# EasyEDA Pro project 弱磁场及磁感应强度矢量综合测量实验仪.eprj

# Schematic FD-MFD-A

## Sheets
1 主板和外围电路: Create Date: 2024-11-11; Page Name: 主板和外围电路; Project Name: 弱磁场及磁感应强度矢量综合测量实验仪; Schematic Name: FD-MFD-A; Update Date: 2026-04-02; Company: 嘉立创EDA; Page Size: A4; Version: V1.0
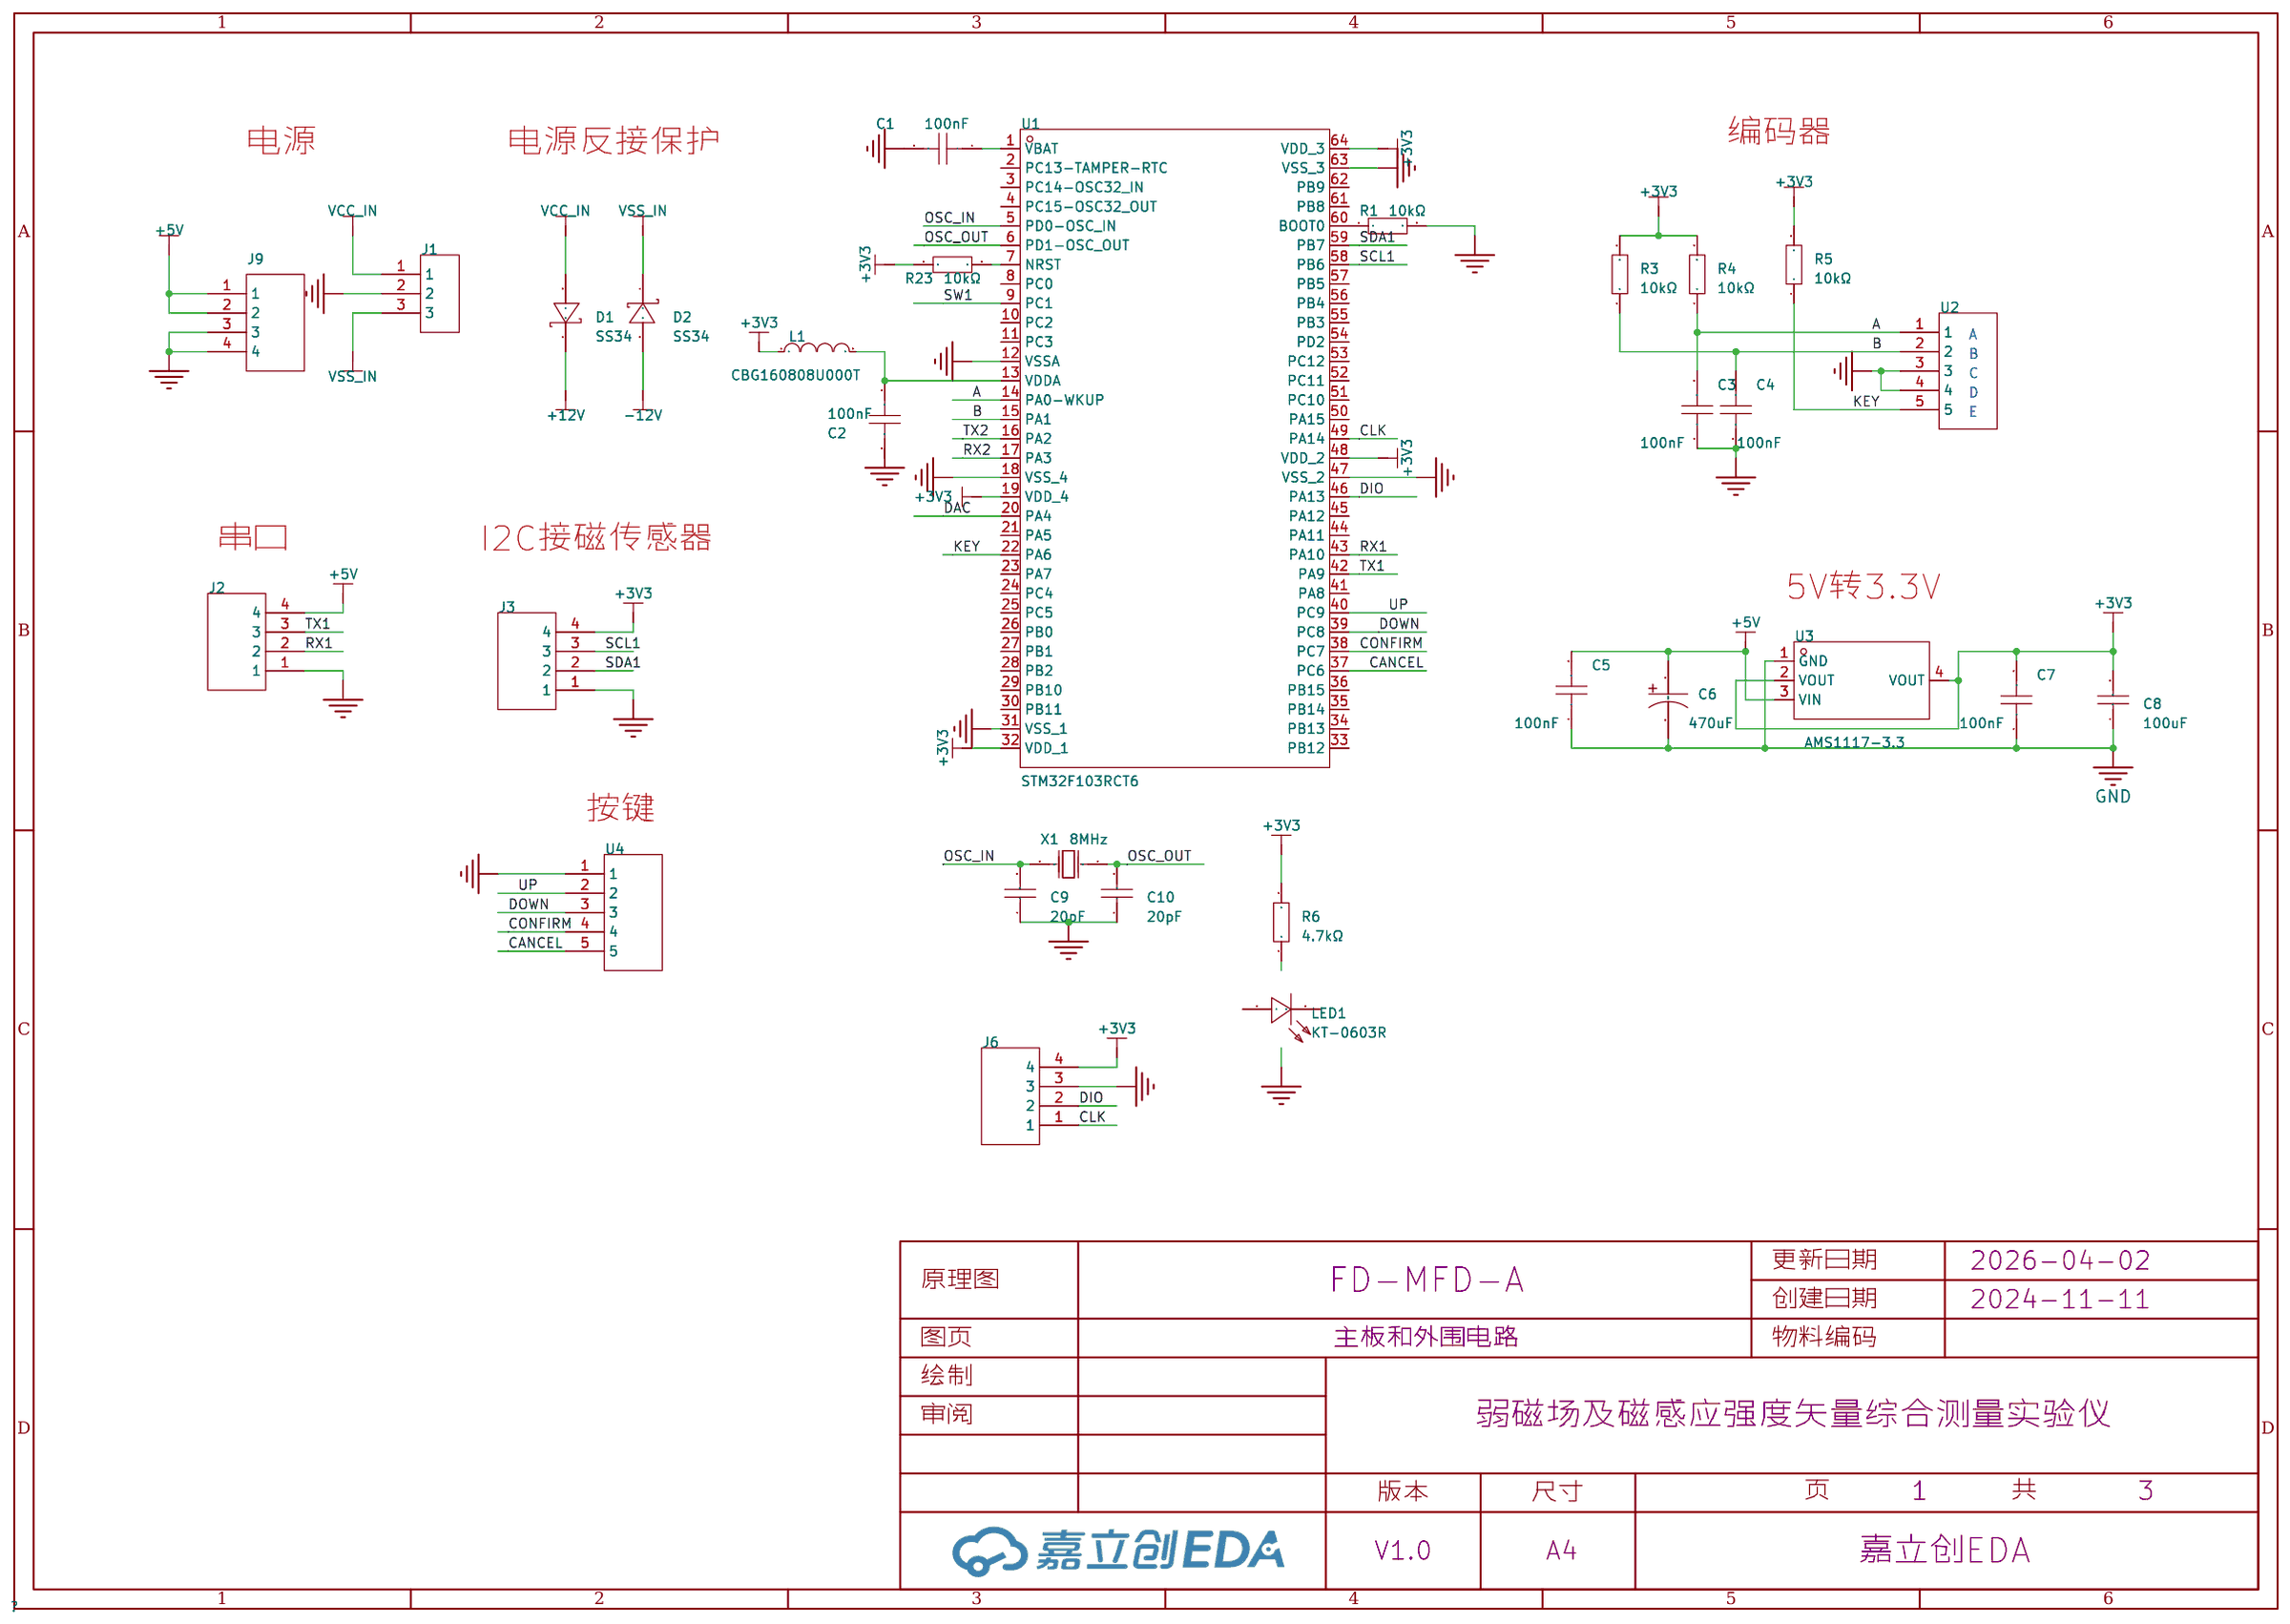
[diagram p0: 主板和外围电路]
2 压控恒流源: Create Date: 2025-02-17; Page Name: 压控恒流源; Update Date: 2025-02-21
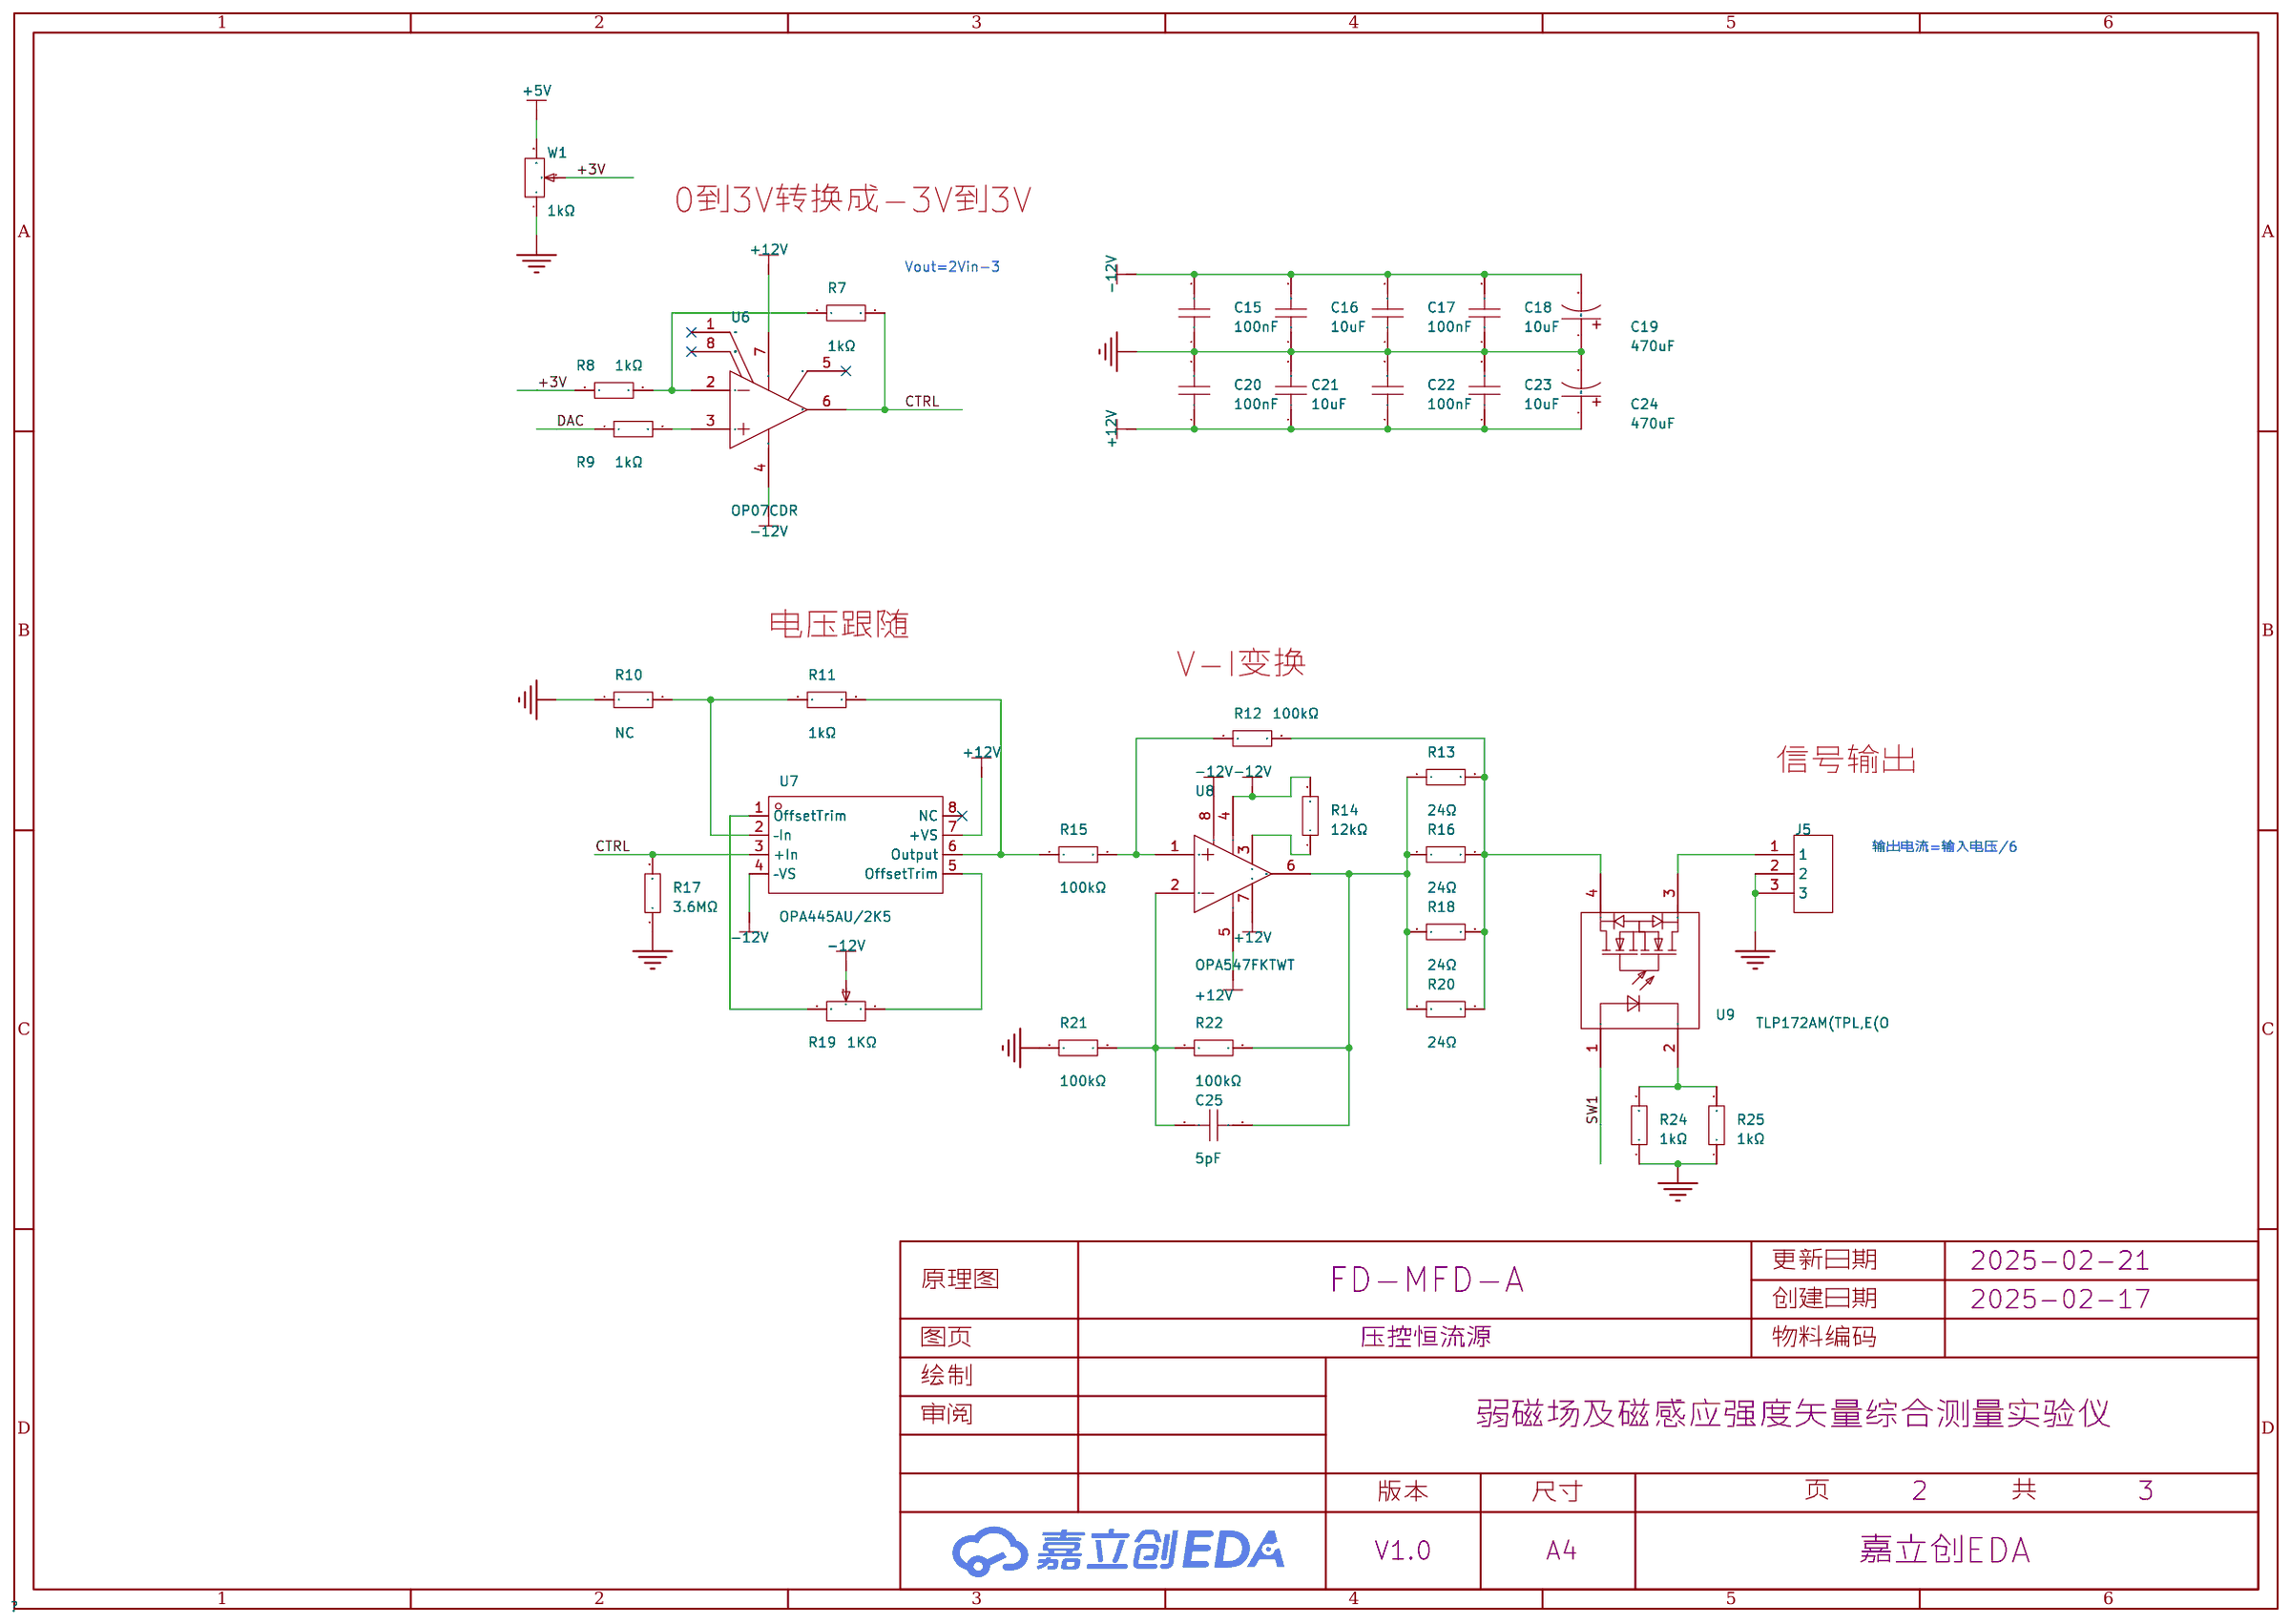
[diagram p1: 压控恒流源]
3 CH376: Create Date: 2025-03-05; Page Name: CH376; Update Date: 2025-03-05
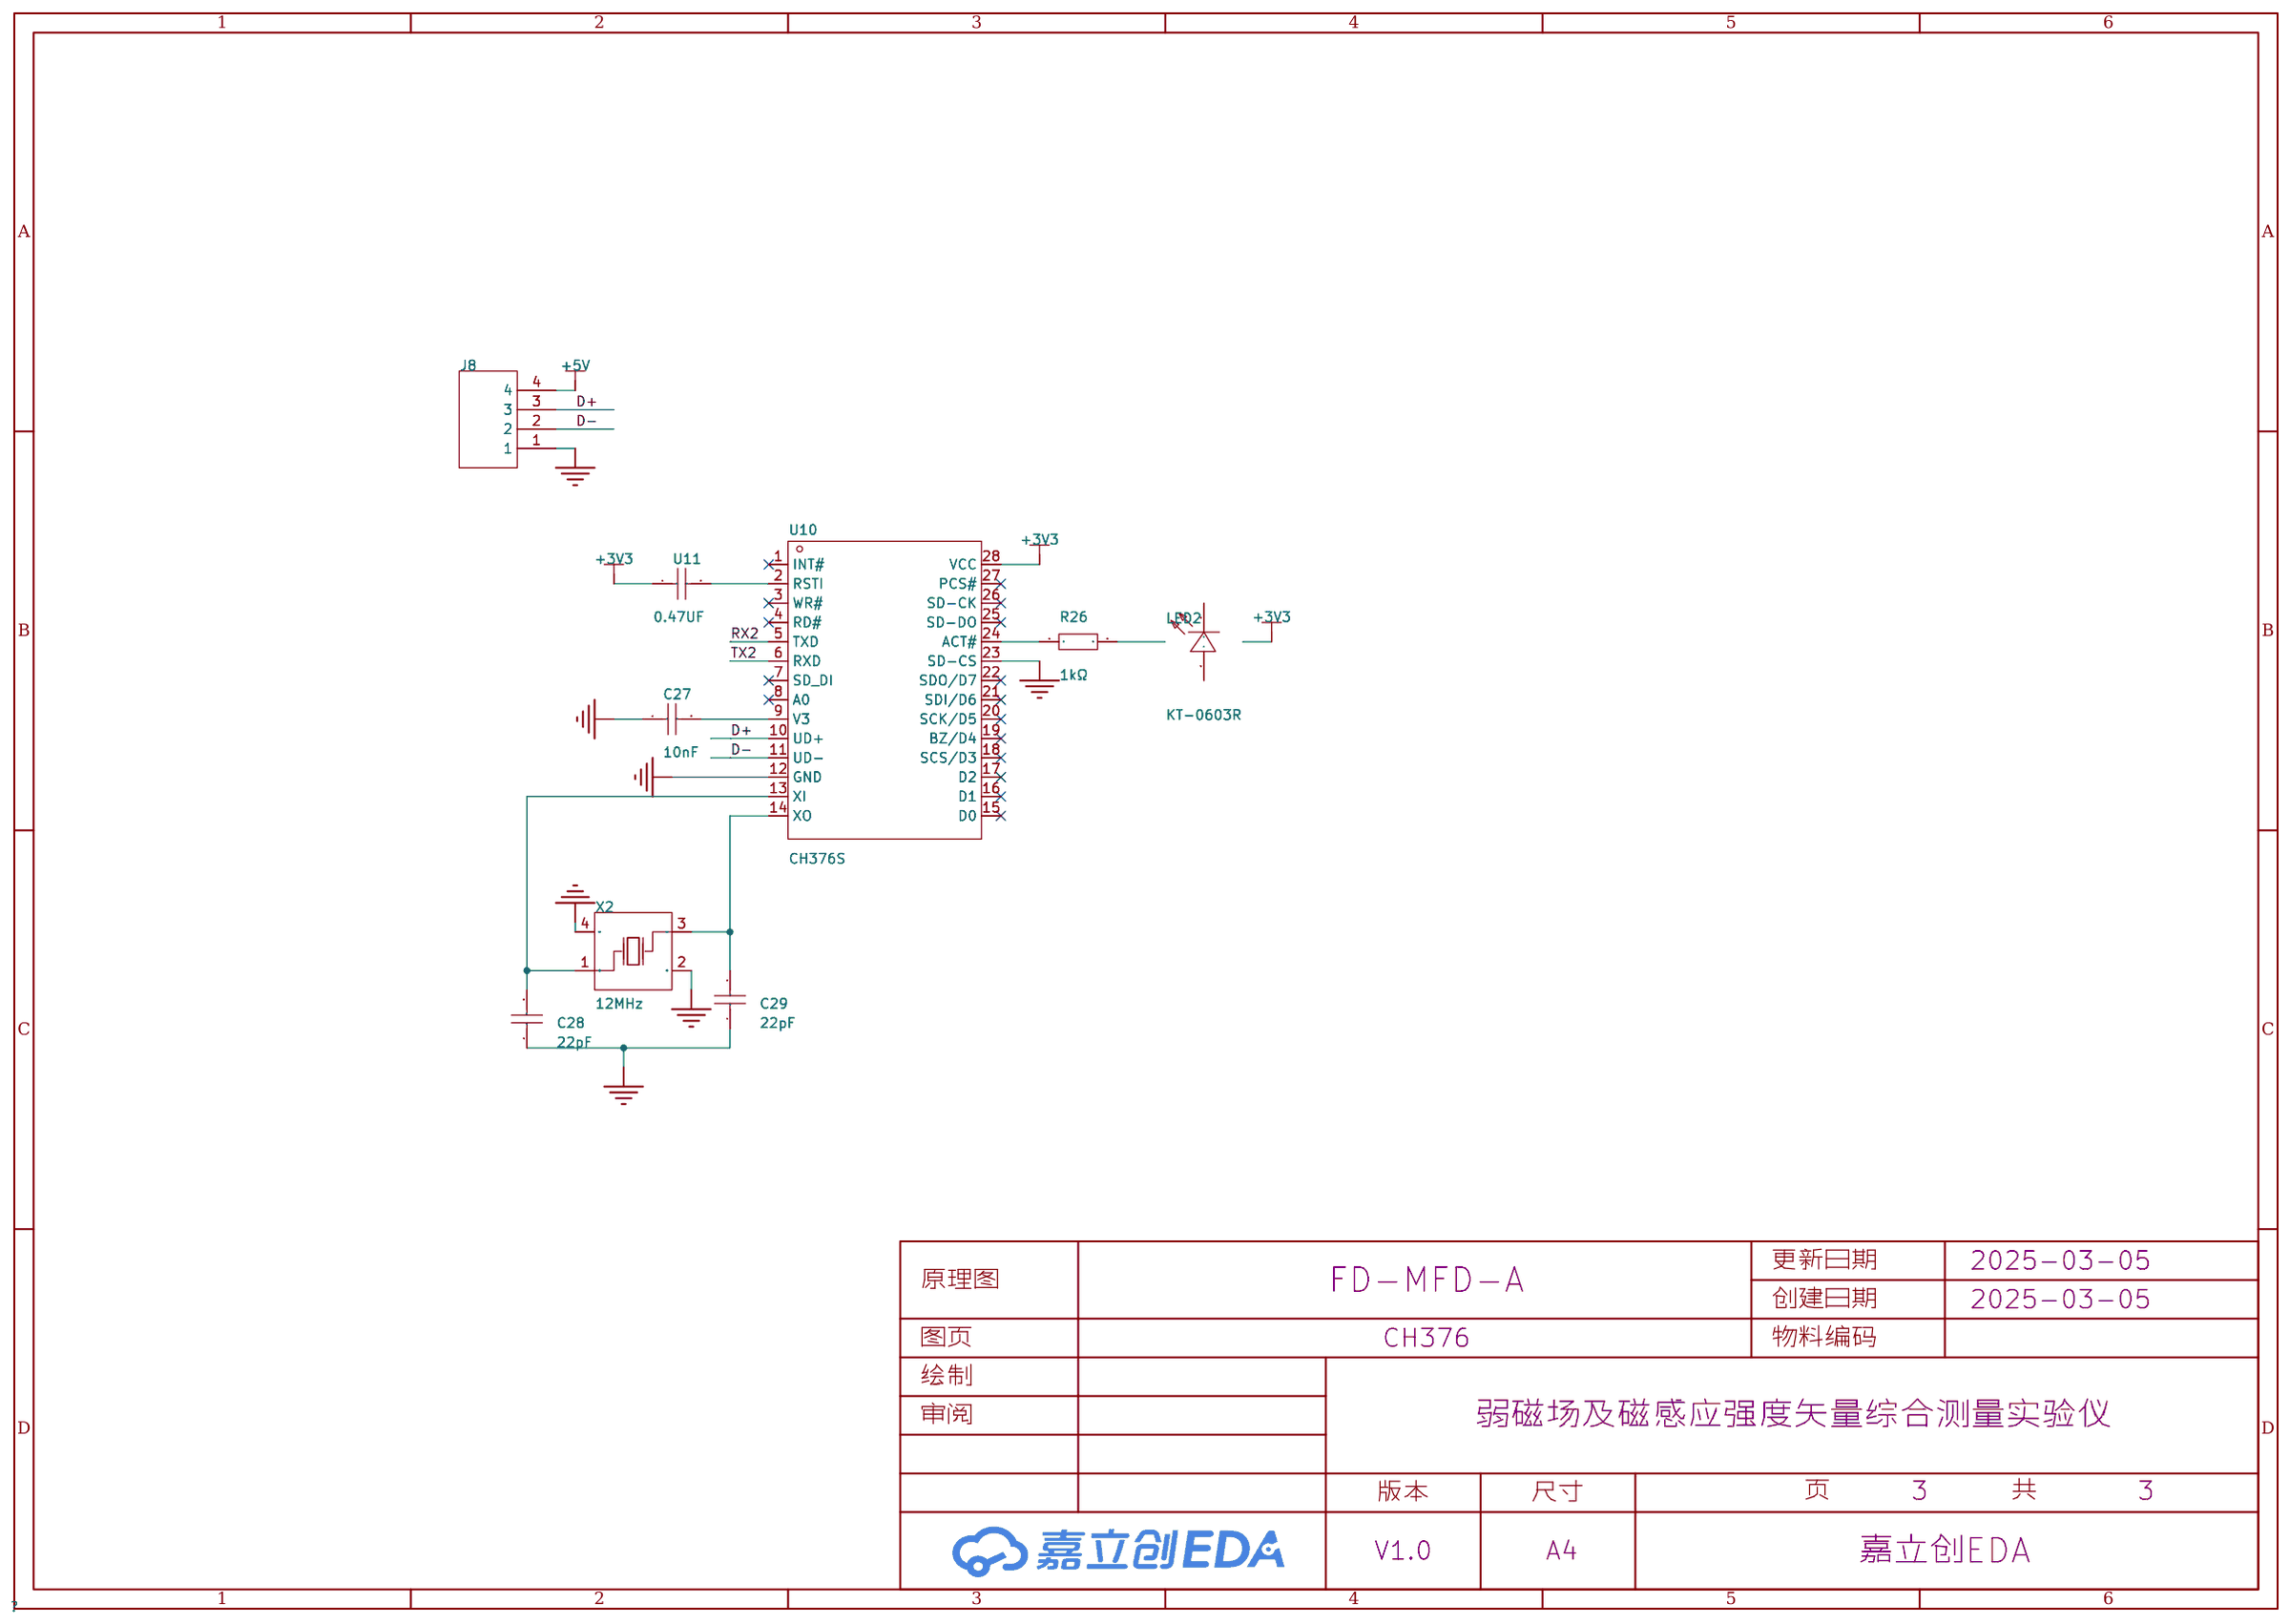
[diagram p2: CH376]

## Parts
sheet CH376
C27  10nF  [C0603]
C28  22pF  [C0603]
C29  22pF  [C0603]
J8  -  [CH2.54-4插座]
LED2  KT-0603R  [LED0603-RD]
R26  1kΩ  [R0603]
U10  CH376S  [SOIC-28_L17.9-W7.5-P1.27-LS10.3-BL]
U11  0.47UF  [C0603]
X2  12MHz  [CRYSTAL-SMD_4P-L3.2-W2.5-BL]
sheet 主板和外围电路
C1  100nF  [C0402]
C2  100nF  [C0402]
C3  100nF  [C0402]
C4  100nF  [C0402]
C5  100nF  [C0402]
C6  470uF  [cap-th_bd8.0-p3.50-d0.6-fd_1]
C7  100nF  [C0402]
C8  100uF  [C1206]
C9  20pF  [C0603]
C10  20pF  [C0603]
D1  SS34  [SMA_L4.3-W2.6-LS5.2-RD]
D2  SS34  [SMA_L4.3-W2.6-LS5.2-RD]
J1  -  [CH2.54-3插座]
J2  -  [CH2.54-4插座]
J3  -  [CH2.54-4插座]
J6  -  [CH2.54-4插座]
J9  -  [CH2.54-4插座]
L1  CBG160808U000T  [L0603]
LED1  KT-0603R  [LED0603-RD]
R1  10kΩ  [R0402]
R3  10kΩ  [R0805]
R4  10kΩ  [R0805]
R5  10kΩ  [R0805]
R6  4.7kΩ  [R0603]
R23  10kΩ  [R0402]
U1  STM32F103RCT6  [LQFP-64_L10.0-W10.0-P0.50-LS12.0-BL]
U2  -  [CH2.54-5插座]
U3  AMS1117-3.3  [SOT-223-3_L6.5-W3.4-P2.30-LS7.0-BR]
U4  -  [CH2.54-5插座]
X1  8MHz  [CRYSTAL-SMD_L11.5-W4.8-LS12.7]
sheet 压控恒流源
C15  100nF  [C0603]
C16  10uF  [C0603]
C17  100nF  [C0603]
C18  10uF  [C0603]
C19  470uF  [cap-th_bd8.0-p3.50-d0.6-fd_1]
C20  100nF  [C0603]
C21  10uF  [C0603]
C22  100nF  [C0603]
C23  10uF  [C0603]
C24  470uF  [cap-th_bd8.0-p3.50-d0.6-fd_1]
C25  5pF  [C0603]
J5  -  [CH2.54-3插座]
R7  1kΩ  [R0603]
R8  1kΩ  [R0603]
R9  1kΩ  [R0603]
R10  NC  [R0603]
R11  1kΩ  [R0603]
R12  100kΩ  [R0603]
R13  24Ω  [R0603]
R14  12kΩ  [R0603]
R15  100kΩ  [R0603]
R16  24Ω  [R0603]
R17  3.6MΩ  [R0603]
R18  24Ω  [R0603]
R19  1KΩ  [RES-ADJ-TH_3296W]
R20  24Ω  [R0603]
R21  100kΩ  [R0603]
R22  100kΩ  [R0603]
R24  1kΩ  [R0402]
R25  1kΩ  [R0402]
U6  OP07CDR  [SOIC-8_L4.9-W3.9-P1.27-LS6.0-BL]
U7  OPA445AU/2K5  [SOIC-8_L4.9-W3.9-P1.27-LS6.0-BL]
U8  OPA547FKTWT  [DDPAK-7_L10.2-W8.9-P1.27-LS14.0-BR]
U9  TLP172AM(TPL,E(O  [SMD-4_L4.6-W3.7-P2.54-LS7.0-BR]
W1  1kΩ  [RES-ADJ-TH_3296W]

## Library data of the parts
C27 = 0603B103K500NT: 容值:10nF;精度:±10%;额定电压:50V;材质(温度系数):X7R;; LCSC Part Name: 10nF ±10% 50V; Supplier Part: C57112; Manufacturer: FH(风华); Supplier Footprint: 0603; JLCPCB Part Class: 基础库; Datasheet: https://atta.szlcsc.com/upload/public/pdf/source/20200305/C486355_26A10D38EF8C2A5C37091D0039909270.pdf; Supplier: LCSC; Tolerance: ±10%; Voltage Rated: 50V; Temperature Coefficient: X7R
C28 C29 = CL10C220JB8NNNC: 容值:22pF;精度:±5%;额定电压:50V;材质(温度系数):C0G;; LCSC Part Name: 22pF ±5% 50V; Supplier Part: C1653; Manufacturer: SAMSUNG(三星); Supplier Footprint: 0603; JLCPCB Part Class: 基础库; Datasheet: https://atta.szlcsc.com/upload/public/pdf/source/20160218/1457707763339.pdf; Supplier: LCSC; Tolerance: ±5%; Voltage Rated: 50V; Temperature Coefficient: C0G
J2 J3 J6 J8 J9 = HDR-4P
LED1 LED2 = KT-0603R: 发光颜色:红色;功率:-;正向电流:-;主波长:-;二极管配置:-;透镜颜色:-;色温:-;发光角度:-;载带方式:-;工作温度:-40℃~+85℃;; LCSC Part Name: 0603 红灯 高亮; Supplier Part: C2286; Manufacturer: KENTO; Supplier Footprint: 0603; JLCPCB Part Class: 基础库; Datasheet: https://atta.szlcsc.com/upload/public/pdf/source/20160616/1466072038404.pdf; Supplier: LCSC; Emitted Color: 红色; Operating Temperature: -40℃~+85℃
R7-R11 R26 = 0603WAF1001T5E: 电阻类型:厚膜电阻;阻值:1kΩ;精度:±1%;功率:100mW;最大工作电压:75V;温度系数:±100ppm/℃;; LCSC Part Name: 1kΩ ±1% 100mW 厚膜电阻; Supplier Part: C21190; Manufacturer: UNI-ROYAL(厚声); Supplier Footprint: 0603; JLCPCB Part Class: 基础库; Datasheet: https://atta.szlcsc.com/upload/public/pdf/source/20200306/C422600_1E6D84923E4A46A82E41ADD87F860B5C.pdf; Supplier: LCSC; Type: 厚膜电阻; Tolerance: ±1%; Power(Watts): 100mW; Overload Voltage (Max): 75V; Temperature Coefficient: ±100ppm/℃; Operating Temperature Range: -55℃~+155℃
U10 = CH376S: 应用功能:收发器;接口协议:USB 2.0;数据速率:12Mbps;; Supplier Part: C14166; Manufacturer: WCH(南京沁恒); Supplier Footprint: SOP-28-300mil; JLCPCB Part Class: 扩展库; Datasheet: https://atta.szlcsc.com/upload/public/pdf/source/20240313/780B8519D8DF2DCF0D579C39FFA4C063.pdf; Supplier: LCSC; Applications Function: 收发器; Protocol: USB 2.0; Supply Voltage: 3.3V；5V; Data Rate: 12Mbps
U11 = CAPCER0.47UF25VX7R0603: Supplier Part: C9900012837; JLCPCB Part Class: 扩展库; Supplier: LCSC
X2 = X322512MSB4SI: 晶振类型:贴片晶振;频率:12MHz;常温频差:±10ppm;外接负载电容:20pF;频率稳定度(全温):±20ppm;; LCSC Part Name: 12MHz ±10ppm 20pF; Supplier Part: C9002; Manufacturer: YXC(扬兴晶振); Supplier Footprint: SMD3225-4P; JLCPCB Part Class: 基础库; Datasheet: https://atta.szlcsc.com/upload/public/pdf/source/20240329/19D5F850207469550BEB00D7DFEDBC7A.pdf; Supplier: LCSC; Crystal Type: 贴片晶振; Normal temperature Frequency Tolerance: ±10ppm; External load capacitor: 20pF; Frequency Stability(Full temperature range): ±20ppm; Operating Temperature: -40℃~+85℃
C1-C5 C7 = CL05B104KB54PNC: 容值:100nF;精度:±10%;额定电压:50V;材质(温度系数):X7R;; LCSC Part Name: 100nF ±10% 50V; Supplier Part: C307331; Manufacturer: SAMSUNG(三星); Supplier Footprint: 0402; JLCPCB Part Class: 基础库; Datasheet: https://atta.szlcsc.com/upload/public/pdf/source/20160218/1457707763339.pdf; Supplier: LCSC; Tolerance: ±10%; Voltage Rated: 50V; Temperature Coefficient: X7R
C6 C19 C24 = RVT1A471M0607_C335982: 容值:470uF;精度:±20%;额定电压:10V;纹波电流:200mA@120Hz;等效串联电阻:-;; LCSC Part Name: 470uF ±20% 10V; Supplier Part: C335982; Manufacturer: ROQANG(容强); Manufacturer Part: RVT1A471M0607; Supplier Footprint: SMD,D6.3xL7.7mm; Datasheet: https://atta.szlcsc.com/upload/public/pdf/source/20181128/C335987_23CA7AA50FB42690DF736C43FE112376.pdf; Supplier: LCSC; Tolerance: ±20%; Rated Voltage: 10V; Ripple Current: 200mA@120Hz; φD: 6.3mm; L: 7.7mm; Lifetime @ Temp: 2000hrs@105℃; Operating Temperature: -40℃~+105℃
C8 = CL31A107MQHNNNE: 容值:100uF;精度:±20%;额定电压:6.3V;材质(温度系数):X5R;; LCSC Part Name: 100uF ±20% 6.3V; Supplier Part: C15008; Manufacturer: SAMSUNG(三星); Supplier Footprint: 1206; Datasheet: https://atta.szlcsc.com/upload/public/pdf/source/20160218/1457707763339.pdf; Supplier: LCSC; Tolerance: ±20%; Voltage Rated: 6.3V; Temperature Coefficient: X5R
C9 C10 = CL10C200JB8NNNC: 容值:20pF;精度:±5%;额定电压:50V;材质(温度系数):C0G;; LCSC Part Name: 20pF ±5% 50V; Supplier Part: C1648; Manufacturer: SAMSUNG(三星); Supplier Footprint: 0603; JLCPCB Part Class: 基础库; Datasheet: https://atta.szlcsc.com/upload/public/pdf/source/20160218/1457707763339.pdf; Supplier: LCSC; Tolerance: ±5%; Voltage Rated: 50V; Temperature Coefficient: C0G
D1 D2 = SS34_C8678: 二极管配置:独立式;正向压降(Vf):550mV@3A;直流反向耐压(Vr):40V;整流电流:3A;; LCSC Part Name: 电压:40V 电流:3A; Supplier Part: C8678; Manufacturer: MDD(辰达半导体); Supplier Footprint: SMA(DO-214AC); JLCPCB Part Class: 基础库; Datasheet: https://atta.szlcsc.com/upload/public/pdf/source/20240710/2118BB86FDDB2E0B294389AC1F3F65C8.pdf; Supplier: LCSC; Diode Configuration: 独立式; Forward Voltage (Vf@If): 550mV@3A; Reverse Voltage (Vr): 40V; Rectified Current: 3A; Reverse Leakage Current (Ir): 500uA@40V
J1 J5 = HDR-3P
L1 = CBG160808U000T: 标称阻抗@测试频率:0Ω@100MHz;直流电阻(RDC):100mΩ;; LCSC Part Name: 单路 0603磁珠 阻抗0Ω@100MHz; Supplier Part: C43163; Manufacturer: FH(风华); Supplier Footprint: 0603; JLCPCB Part Class: 扩展库; Datasheet: https://atta.szlcsc.com/upload/public/pdf/source/20190129/C361667_1614D407CC98D1D3CFBD9E1F7511C14D.pdf; Supplier: LCSC; Impedance @ Frequency: 0Ω@100MHz; DC Resistance: 100mΩ; Current Rating: 800mA; Circuits: 1
R1 R23 = 0402WGF1002TCE: 电阻类型:厚膜电阻;阻值:10kΩ;精度:±1%;功率:62.5mW;最大工作电压:50V;温度系数:±100ppm/℃;; LCSC Part Name: 10kΩ ±1% 62.5mW 厚膜电阻; Supplier Part: C25744; Manufacturer: UNI-ROYAL(厚声); Supplier Footprint: 0402; JLCPCB Part Class: 基础库; Datasheet: https://atta.szlcsc.com/upload/public/pdf/source/20200306/C422600_1E6D84923E4A46A82E41ADD87F860B5C.pdf; Supplier: LCSC; Type: 厚膜电阻; Tolerance: ±1%; Power(Watts): 62.5mW; Overload Voltage (Max): 50V; Temperature Coefficient: ±100ppm/℃; Operating Temperature Range: -55℃~+155℃
R3-R5 = 0805W8F1002T5E_C17414: 电阻类型:厚膜电阻;阻值:10kΩ;精度:±1%;功率:125mW;最大工作电压:150V;温度系数:±100ppm/℃;; LCSC Part Name: 10kΩ ±1% 125mW 厚膜电阻; Supplier Part: C17414; Manufacturer: UNI-ROYAL(厚声); Manufacturer Part: 0805W8F1002T5E; Supplier Footprint: 0805; JLCPCB Part Class: 基础库; Datasheet: https://atta.szlcsc.com/upload/public/pdf/source/20200306/C422600_1E6D84923E4A46A82E41ADD87F860B5C.pdf; Supplier: LCSC; Type: 厚膜电阻; Tolerance: ±1%; Power(Watts): 125mW; Overload Voltage (Max): 150V; Temperature Coefficient: ±100ppm/℃; Operating Temperature Range: -55℃~+155℃
R6 = 0603WAF4701T5E: 电阻类型:厚膜电阻;阻值:4.7kΩ;精度:±1%;功率:100mW;最大工作电压:75V;温度系数:±100ppm/℃;; LCSC Part Name: 4.7kΩ ±1% 100mW 厚膜电阻; Supplier Part: C23162; Manufacturer: UNI-ROYAL(厚声); Supplier Footprint: 0603; JLCPCB Part Class: 基础库; Datasheet: https://atta.szlcsc.com/upload/public/pdf/source/20200306/C422600_1E6D84923E4A46A82E41ADD87F860B5C.pdf; Supplier: LCSC; Type: 厚膜电阻; Tolerance: ±1%; Power(Watts): 100mW; Overload Voltage (Max): 75V; Temperature Coefficient: ±100ppm/℃; Operating Temperature Range: -55℃~+155℃
U1 = STM32F103RCT6: CPU内核:ARM-M3;CPU最大主频:72MHz;应用领域:-;; LCSC Part Name: 主流增强型ARM Cortex-M3 MCU，具有256 KB Flash、72 MHz CPU、电机控制、USB和CAN; Supplier Part: C8323; Manufacturer: ST(意法半导体); Supplier Footprint: LQFP-64(10x10); JLCPCB Part Class: 扩展库; Datasheet: https://atta.szlcsc.com/upload/public/pdf/source/20180207/C88442_15179953708671359491.pdf; Supplier: LCSC; CPU Core: ARM-M3; CPU Maximum Speed: 72MHz; Program Storage Size: 256KB; Program Memory Type: FLASH; Number of I/O: 51; ADC (Bit): 12bit; DAC (Bit): 12bit; Low Voltage Detection Threshold: 2V~3.6V
U2 U4 = HDR-5P
U3 = AMS1117-3.3_C6186: 输出类型:固定;最大输入电压:-;输出电压:3.3V;最大输出电流:1A;电源纹波抑制比(PSRR):72dB@(120Hz);输出极性:正极;; LCSC Part Name: 输出3.3V 1A; Supplier Part: C6186; Manufacturer: AMS; Supplier Footprint: SOT-223; Datasheet: https://atta.szlcsc.com/upload/public/pdf/source/20180727/C6186_7A095716F0823C02F1997A905E26C086.pdf; Supplier: LCSC; Output Type: 固定; Output Voltage: 3.3V; MAX Output Current: 1A; Power Supply Rejection Ratio (PSRR): 72dB@(120Hz); Dropout Voltage: 1.3V@(800mA); Output Polarity: 正极; Number of Outputs: 1
X1 = X49SM8MSD2SC: 晶振类型:贴片晶振;频率:8MHz;常温频差:±20ppm;外接负载电容:20pF;频率稳定度(全温):±30ppm;; LCSC Part Name: 8MHz ±20ppm 20pF; Supplier Part: C12674; Manufacturer: YXC(扬兴晶振); Supplier Footprint: HC-49S-SMD; JLCPCB Part Class: 基础库; Datasheet: https://atta.szlcsc.com/upload/public/pdf/source/20240329/3EBF42EBCAB50CA65B6FA9D7CFA1955A.pdf; Supplier: LCSC; Crystal Type: 贴片晶振; Normal temperature Frequency Tolerance: ±20ppm; External load capacitor: 20pF; Frequency Stability(Full temperature range): ±30ppm; Operating Temperature: -20℃~+70℃
C15 C17 C20 C22 = CC0603KRX7R9BB104: 容值:100nF;精度:±10%;额定电压:50V;材质(温度系数):X7R;; LCSC Part Name: 100nF ±10% 50V; Supplier Part: C14663; Manufacturer: YAGEO(国巨); Supplier Footprint: 0603; JLCPCB Part Class: 基础库; Datasheet: https://atta.szlcsc.com/upload/public/pdf/source/20180910/C282072_33301C7F631E79921B82A8DAC6BCC5B3.pdf; Supplier: LCSC; Tolerance: ±10%; Voltage Rated: 50V; Temperature Coefficient: X7R
C16 C18 C21 C23 = CL10A106MA8NRNC: 容值:10uF;精度:±20%;额定电压:25V;材质(温度系数):X5R;; LCSC Part Name: 10uF ±20% 25V; Supplier Part: C96446; Manufacturer: SAMSUNG(三星); Supplier Footprint: 0603; JLCPCB Part Class: 基础库; Datasheet: https://atta.szlcsc.com/upload/public/pdf/source/20160218/1457707763339.pdf; Supplier: LCSC; Tolerance: ±20%; Voltage Rated: 25V; Temperature Coefficient: X5R
C25 = CGA3E2C0G2A050C080AA: 容值:5pF;额定电压:100V;材质(温度系数):C0G;; LCSC Part Name: 5pF 100V ±0.25pF; Supplier Part: C3879212; Manufacturer: TDK; Supplier Footprint: 0603; JLCPCB Part Class: 扩展库; Datasheet: https://atta.szlcsc.com/upload/public/pdf/source/20230606/D94174B26D5D12F87246C65F1689D091.pdf; Supplier: LCSC; Voltage Rated: 100V; Temperature Coefficient: C0G
R12 R15 R21 R22 = 0603WAF1003T5E: 电阻类型:厚膜电阻;阻值:100kΩ;精度:±1%;功率:100mW;最大工作电压:75V;温度系数:±100ppm/℃;; LCSC Part Name: 100kΩ ±1% 100mW 厚膜电阻; Supplier Part: C25803; Manufacturer: UNI-ROYAL(厚声); Supplier Footprint: 0603; JLCPCB Part Class: 基础库; Datasheet: https://atta.szlcsc.com/upload/public/pdf/source/20200306/C422600_1E6D84923E4A46A82E41ADD87F860B5C.pdf; Supplier: LCSC; Type: 厚膜电阻; Tolerance: ±1%; Power(Watts): 100mW; Overload Voltage (Max): 75V; Temperature Coefficient: ±100ppm/℃; Operating Temperature Range: -55℃~+155℃
R13 R16 R18 R20 = 0603WAF240JT5E: 电阻类型:厚膜电阻;阻值:24Ω;精度:±1%;功率:100mW;最大工作电压:75V;温度系数:±200ppm/℃;; LCSC Part Name: 24Ω ±1% 100mW 厚膜电阻; Supplier Part: C4198; Manufacturer: UNI-ROYAL(厚声); Supplier Footprint: 0603; JLCPCB Part Class: 扩展库; Datasheet: https://atta.szlcsc.com/upload/public/pdf/source/20200306/C422600_1E6D84923E4A46A82E41ADD87F860B5C.pdf; Supplier: LCSC; Type: 厚膜电阻; Tolerance: ±1%; Power(Watts): 100mW; Overload Voltage (Max): 75V; Temperature Coefficient: ±200ppm/℃; Operating Temperature Range: -55℃~+155℃
R14 = 0603WAF1202T5E: 电阻类型:厚膜电阻;阻值:12kΩ;精度:±1%;功率:100mW;最大工作电压:75V;温度系数:±100ppm/℃;; LCSC Part Name: 12kΩ ±1% 100mW 厚膜电阻; Supplier Part: C22790; Manufacturer: UNI-ROYAL(厚声); Supplier Footprint: 0603; JLCPCB Part Class: 基础库; Datasheet: https://atta.szlcsc.com/upload/public/pdf/source/20200306/C422600_1E6D84923E4A46A82E41ADD87F860B5C.pdf; Supplier: LCSC; Type: 厚膜电阻; Tolerance: ±1%; Power(Watts): 100mW; Overload Voltage (Max): 75V; Temperature Coefficient: ±100ppm/℃; Operating Temperature Range: -55℃~+155℃
R17 = RTT03365JTP: 电阻类型:厚膜电阻;阻值:3.6MΩ;精度:±5%;功率:100mW;最大工作电压:75V;温度系数:±100ppm/℃;; LCSC Part Name: 厚膜电阻 3.6MΩ ±5% 100mW; Supplier Part: C103584; Manufacturer: RALEC(旺诠); Supplier Footprint: 0603; JLCPCB Part Class: 扩展库; Datasheet: https://atta.szlcsc.com/upload/public/pdf/source/20191219/C158410_884373A5B7E1BC76BF57BC45A946C093.pdf; Supplier: LCSC; Type: 厚膜电阻; Tolerance: ±5%; Power(Watts): 100mW; Overload Voltage (Max): 75V; Temperature Coefficient: ±100ppm/℃; Operating Temperature Range: -55℃~+155℃
R19 = 环保 3296W-1-202LF: 阻值:-;功率:-;; LCSC Part Name: 2KΩ ±10% ±250ppm/℃; Supplier Part: C5028; Supplier Footprint: 3296W; JLCPCB Part Class: 扩展库; Supplier: LCSC
R24 R25 = 0402WGF1001TCE: 电阻类型:厚膜电阻;阻值:1kΩ;精度:±1%;功率:62.5mW;最大工作电压:50V;温度系数:±100ppm/℃;; LCSC Part Name: 1kΩ ±1% 62.5mW 厚膜电阻; Supplier Part: C11702; Manufacturer: UNI-ROYAL(厚声); Supplier Footprint: 0402; Datasheet: https://atta.szlcsc.com/upload/public/pdf/source/20200306/C422600_1E6D84923E4A46A82E41ADD87F860B5C.pdf; Supplier: LCSC; Type: 厚膜电阻; Tolerance: ±1%; Power(Watts): 62.5mW; Overload Voltage (Max): 50V; Temperature Coefficient: ±100ppm/℃; Operating Temperature Range: -55℃~+155℃
U6 = OP07CDR: 放大器数:单路;增益带宽积(GBP):600kHz;输入偏置电流(Ib):1.8nA;压摆率(SR):0.3V/us;轨到轨:-;; LCSC Part Name: 精密运算放大器; Supplier Part: C7433; Manufacturer: TI(德州仪器); Supplier Footprint: SOIC-8; JLCPCB Part Class: 基础库; Datasheet: http://www.ti.com/cn/lit/gpn/op07c; Supplier: LCSC; Number of Circuits: 单路; Gain Bandwidth Product(GBP): 600kHz; Current - Input Bias(Ib): 1.8nA; Slew Rate(SR): 0.3V/us; Operating Temperature: 0℃~+70℃
U7 = OPA445AU/2K5: OPA445 高电压 FET 输入运算放大器; Supplier Part: C1348606; Manufacturer: TI(德州仪器); Supplier Footprint: SOIC-8; JLCPCB Part Class: 扩展库; Datasheet: https://www.ti.com/cn/lit/gpn/opa445; Supplier: LCSC
U8 = OPA547FKTWT: 放大器数:单路;增益带宽积(GBP):1MHz;输入偏置电流(Ib):100nA;压摆率(SR):6V/us;带宽(-3db):-;; Supplier Part: C2057541; Manufacturer: TI(德州仪器); Supplier Footprint: TO-263-7; JLCPCB Part Class: 扩展库; Datasheet: https://www.ti.com/cn/lit/gpn/opa547; Supplier: LCSC; Number of Circuits: 单路; Gain Bandwidth Product(GBP): 1MHz; Current - Input Bias(Ib): 100nA; Slew Rate(SR): 6V/us; Output Current: 750mA; Operating Temperature: -40℃~+85℃
U9 = TLP172GM(TPL,E(O: 继电器触点形式:1 Form A(SPST-NO);适用负载类型:AC,DC;正向压降:1.27V;负载电压:350V;连续负载电流:110mA;导通电阻:22Ω;; LCSC Part Name: 1 Form A(SPSTNO) 负载AC,DC 负载电压350V; Supplier Part: C261926; Manufacturer: TOSHIBA(东芝); Supplier Footprint: SOP-4-2.54mm; Datasheet: https://atta.szlcsc.com/upload/public/pdf/source/20180801/C261926_98E6F8A0917C7E31AE8EC16F9B9F81C3.pdf; Supplier: LCSC; Relay Contact Form: 1 Form A(SPST-NO); Load Type: AC,DC; Input Forward Voltage: 1.27V; Voltage - Load: 350V; Continuous Load Current: 110mA; On Resistance: 22Ω; Isolation Voltage(rms): 3.75kV; Turn-on time: 500us; Turn-off time: 100us
W1 = 3296W: 阻值:1kΩ;精度:±10%;温度系数:±100ppm/℃;; LCSC Part Name: 1kΩ ±10%; Supplier Part: C57089; Manufacturer: BOURNS; Manufacturer Part: 3296W-1-102LF; JLCPCB Part Class: Extended Part; Datasheet: https://atta.szlcsc.com/upload/public/pdf/source/20151026/1457707506403.pdf; Supplier: LCSC; Tolerance: ±10%; Temperature Coefficient: ±100ppm/℃

## Nets
+3V: R8.1 W1.2
+3V3: C7.2 C8.2 J3.4 J6.4 L1.1 LED2.2(A) R3.2 R4.2 R5.2 R6.2 R23.1 U1.19(VDD_4) U1.32(VDD_1) U1.48(VDD_2) U1.64(VDD_3) U3.2(VOUT) U3.4(VOUT) U10.28(VCC) U11.1
+5V: C5.2 C6.1 J2.4 J8.4 J9.1 J9.2 U3.3(VIN) W1.3
+12V: C20.1 C21.1 C22.1 C23.1 C24.1 D1.1(K) U6.7(VCC+) U7.7(+VS) U8.5(V+) U8.7(E/S)
-12V: C15.2 C16.2 C17.2 C18.2 C19.2 D2.2(A) R14.2 R19.2 U6.4(VCC-) U7.4(–VS) U8.4(V-) U8.8(V-)
GND: C1.2 C2.2 C3.1 C4.1 C5.1 C6.2 C7.1 C8.1 C9.1 C10.1 C15.1 C16.1 C17.1 C18.1 C19.1 C20.2 C21.2 C22.2 C23.2 C24.2 C27.1 C28.1 C29.1 J1.2 J2.1 J3.1 J5.2 J5.3 J6.3 J8.1 J9.3 J9.4 LED1.1(K) R1.2 R10.1 R17.1 R21.1 R24.1 R25.1 U1.12(VSSA) U1.18(VSS_4) U1.31(VSS_1) U1.47(VSS_2) U1.63(VSS_3) U2.3 U2.4 U3.1(GND) U4.1 U10.12(GND) U10.23(SD-CS) W1.1 X2.2(GND) X2.4(GND)
VCC_IN: D1.2(A) J1.1
VSS_IN: D2.1(K) J1.3
A: C3.2 R4.1 U1.14(PA0-WKUP) U2.1
B: C4.2 R3.1 U1.15(PA1) U2.2
CANCEL: U1.37(PC6) U4.5
CLK: J6.1 U1.49(PA14)
CONFIRM: U1.38(PC7) U4.4
CTRL: R7.2 R17.2 U6.6(OUT) U7.3(+In)
D+: J8.3 U10.10(UD+)
D-: J8.2 U10.11(UD-)
DAC: R9.1 U1.20(PA4)
DIO: J6.2 U1.46(PA13)
DOWN: U1.39(PC8) U4.3
KEY: R5.1 U1.22(PA6) U2.5
OSC_IN: C9.2 U1.5(PD0-OSC_IN) X1.2(OSC2)
OSC_OUT: C10.2 U1.6(PD1-OSC_OUT) X1.1(OSC1)
RX1: J2.2 U1.43(PA10)
RX2: U1.17(PA3) U10.5(TXD)
SCL1: J3.3 U1.58(PB6)
SDA1: J3.2 U1.59(PB7)
SW1: U1.9(PC1) U9.1
TX1: J2.3 U1.42(PA9)
TX2: U1.16(PA2) U10.6(RXD)
UP: U1.40(PC9) U4.2
$1N5288: C1.1 U1.1(VBAT)
$1N5549: R23.2 U1.7(NRST)
$1N5845: R1.1 U1.60(BOOT0)
$1N6099: C2.1 L1.2 U1.13(VDDA)
$1N6322: LED1.2(A) R6.1
$2N1370: R10.2 R11.1 U7.2(–In)
$2N1409: R19.3 U7.1(OffsetTrim)
$2N1488: R19.1 U7.5(OffsetTrim)
$2N1705: R11.2 R15.1 U7.6(Output)
$2N1917: C25.1 R21.2 R22.1 U8.2(IN-)
$2N2163: C25.2 R13.1 R16.1 R18.1 R20.1 R22.2 U8.6(OUT)
$2N2269: R12.1 R15.2 U8.1(IN+)
$2N2430: R14.1 U8.3(ILIM)
$2N2682: R9.2 U6.3(IN+)
$2N2683: R7.1 R8.2 U6.2(IN-)
$2N3318: R24.2 R25.2 U9.2
$2N3340: R12.2 R13.2 R16.2 R18.2 R20.2 U9.4
$2N3364: J5.1 U9.3
$3N166: R26.1 U10.24(ACT#)
$3N256: LED2.1(K) R26.2
$3N657: U10.2(RSTI) U11.2
$3N957: C27.2 U10.9(V3)
$3N1245: C28.2 U10.13(XI) X2.1(OSC1)
$3N1251: C29.2 U10.14(XO) X2.3(OSC2)

Not connected (* = marked no-connect by the designer): U1 2(PC13-TAMPER-RTC) 3(PC14-OSC32_IN) 4(PC15-OSC32_OUT) 8(PC0) 10(PC2) 11(PC3) 21(PA5) 23(PA7) 24(PC4) 25(PC5) 26(PB0) 27(PB1) 28(PB2) 29(PB10) 30(PB11) 33(PB12) 34(PB13) 35(PB14) 36(PB15) 41(PA8) 44(PA11) 45(PA12) 50(PA15) 51(PC10) 52(PC11) 53(PC12) 54(PD2) 55(PB3) 56(PB4) 57(PB5) 61(PB8) 62(PB9); U6 1(OFFSET N1)* 5(NC)* 8(OFFSET N2)*; U7 8(NC)*; U10 1(INT#)* 3(WR#)* 4(RD#)* 7(SD_DI)* 8(A0)* 15(D0)* 16(D1)* 17(D2)* 18(SCS/D3)* 19(BZ/D4)* 20(SCK/D5)* 21(SDI/D6)* 22(SDO/D7)* 25(SD-DO)* 26(SD-CK)* 27(PCS#)*

## Notes on the sheets
sheet 1
- 电源
- 电源反接保护
- 编码器
- A
- B
- C
- D
- E
- 串口
- I2C接磁传感器
- 5V转3.3V
- 按键
sheet 2
- 0到3V转换成-3V到3V
- Vout=2Vin-3
- 电压跟随
- V-I变换
- 信号输出
- 输出电流=输入电压/6

# Board FD-MFD-A
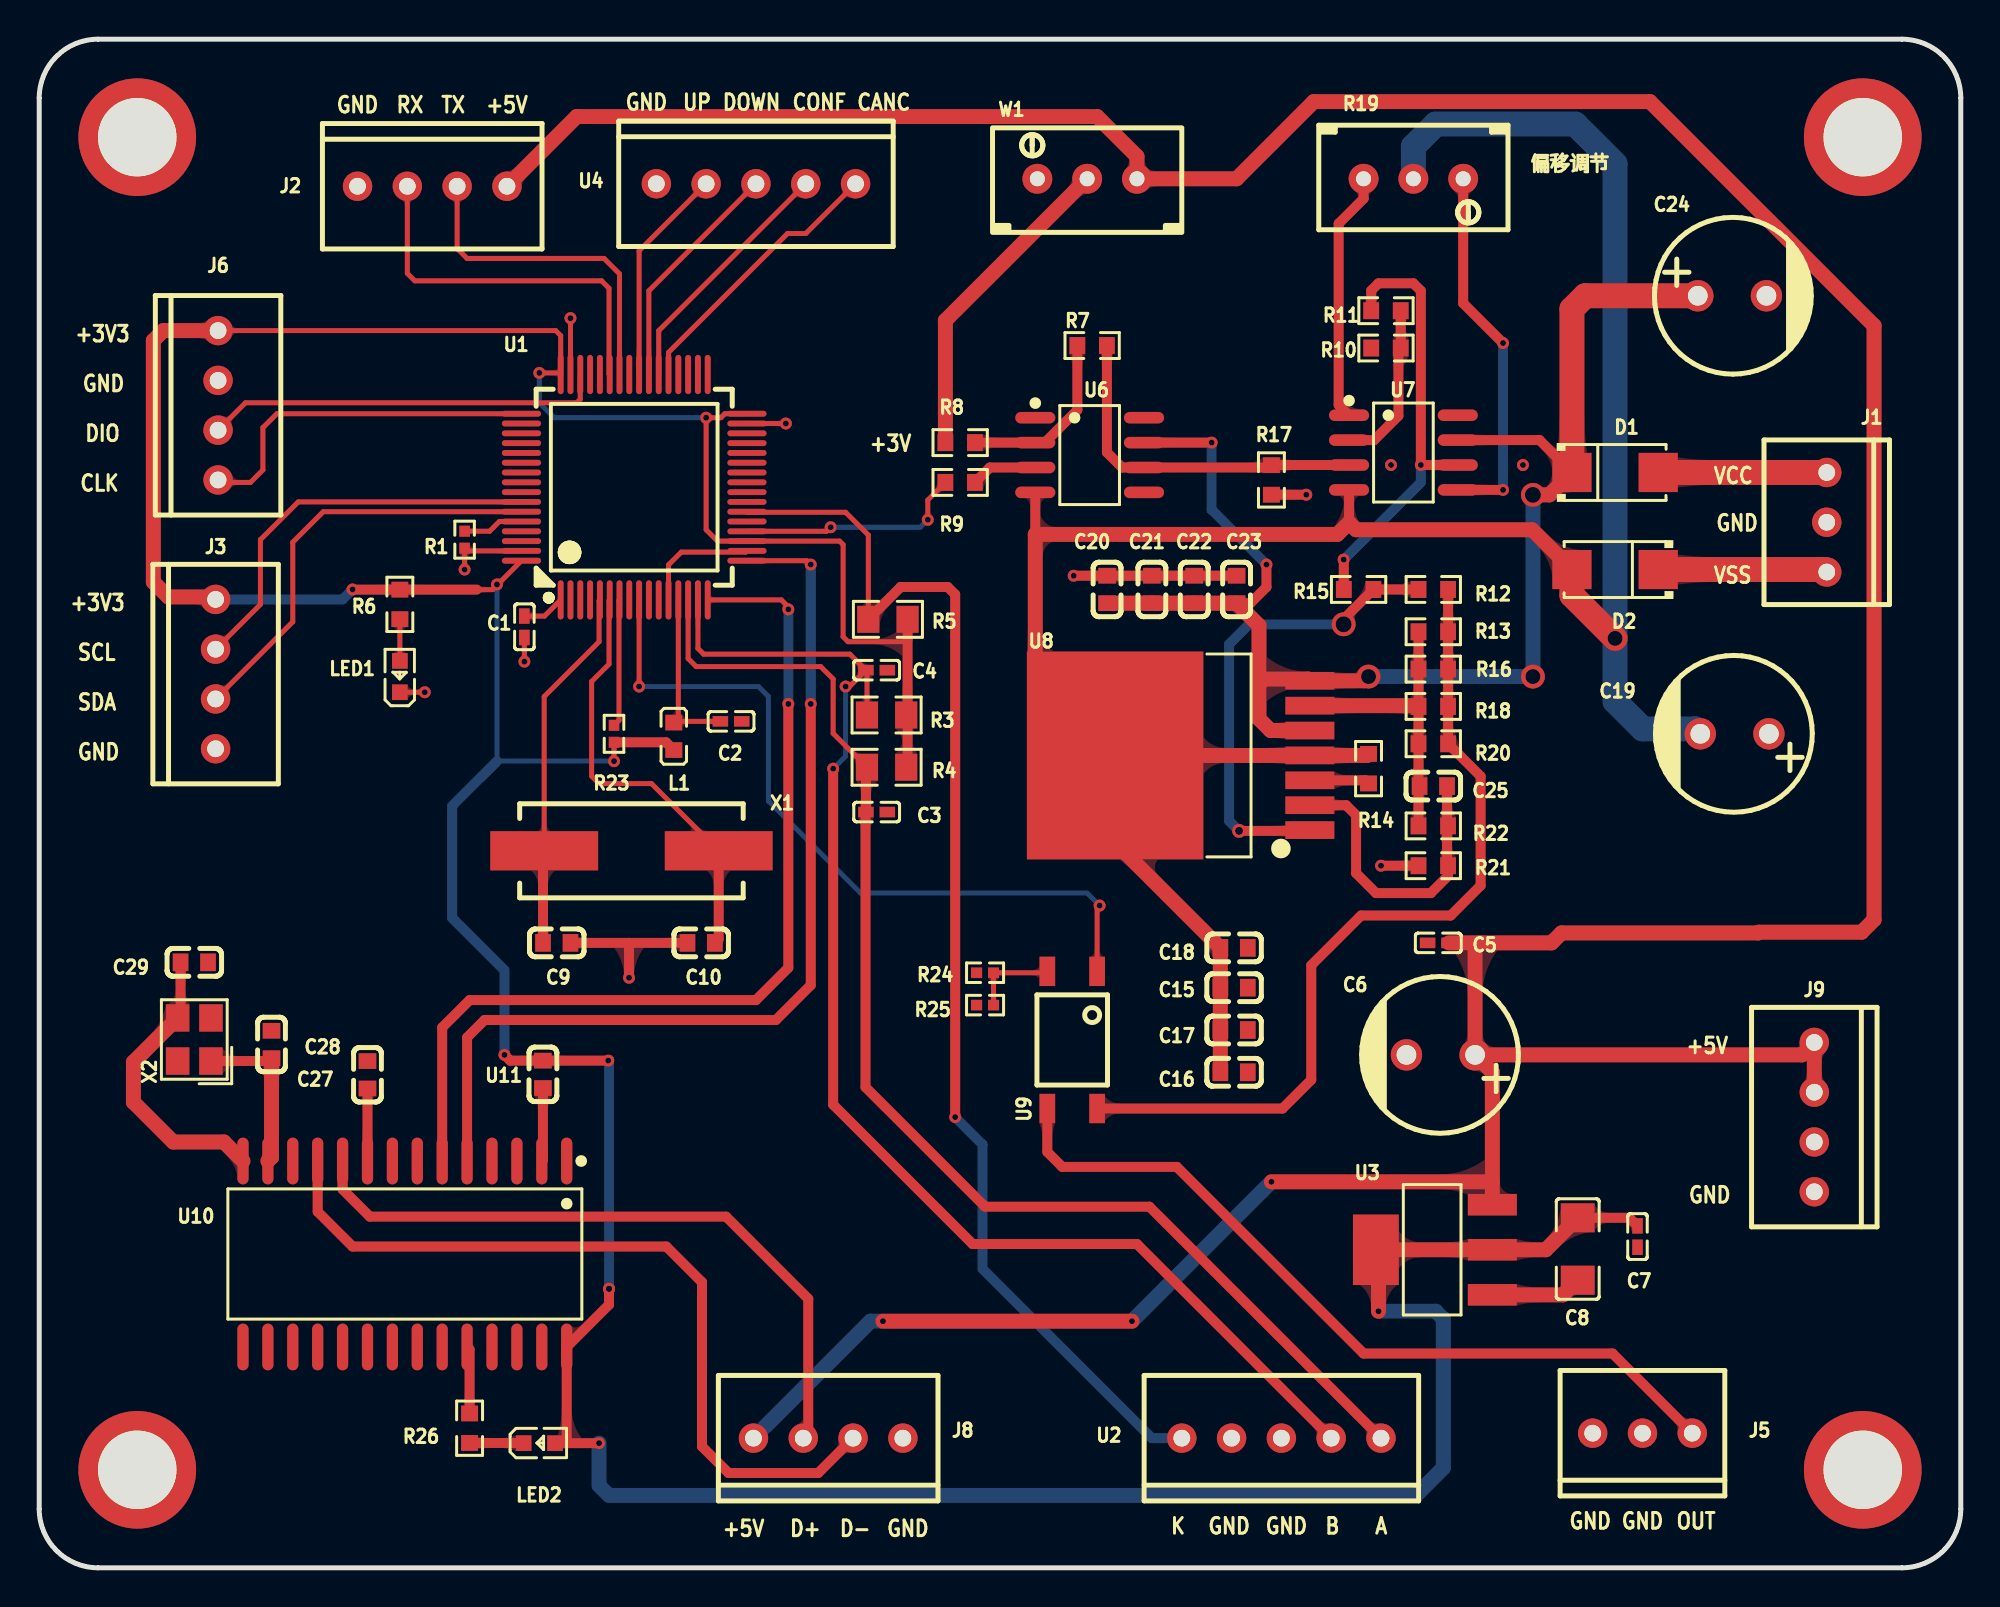
[diagram p3: board, top side]
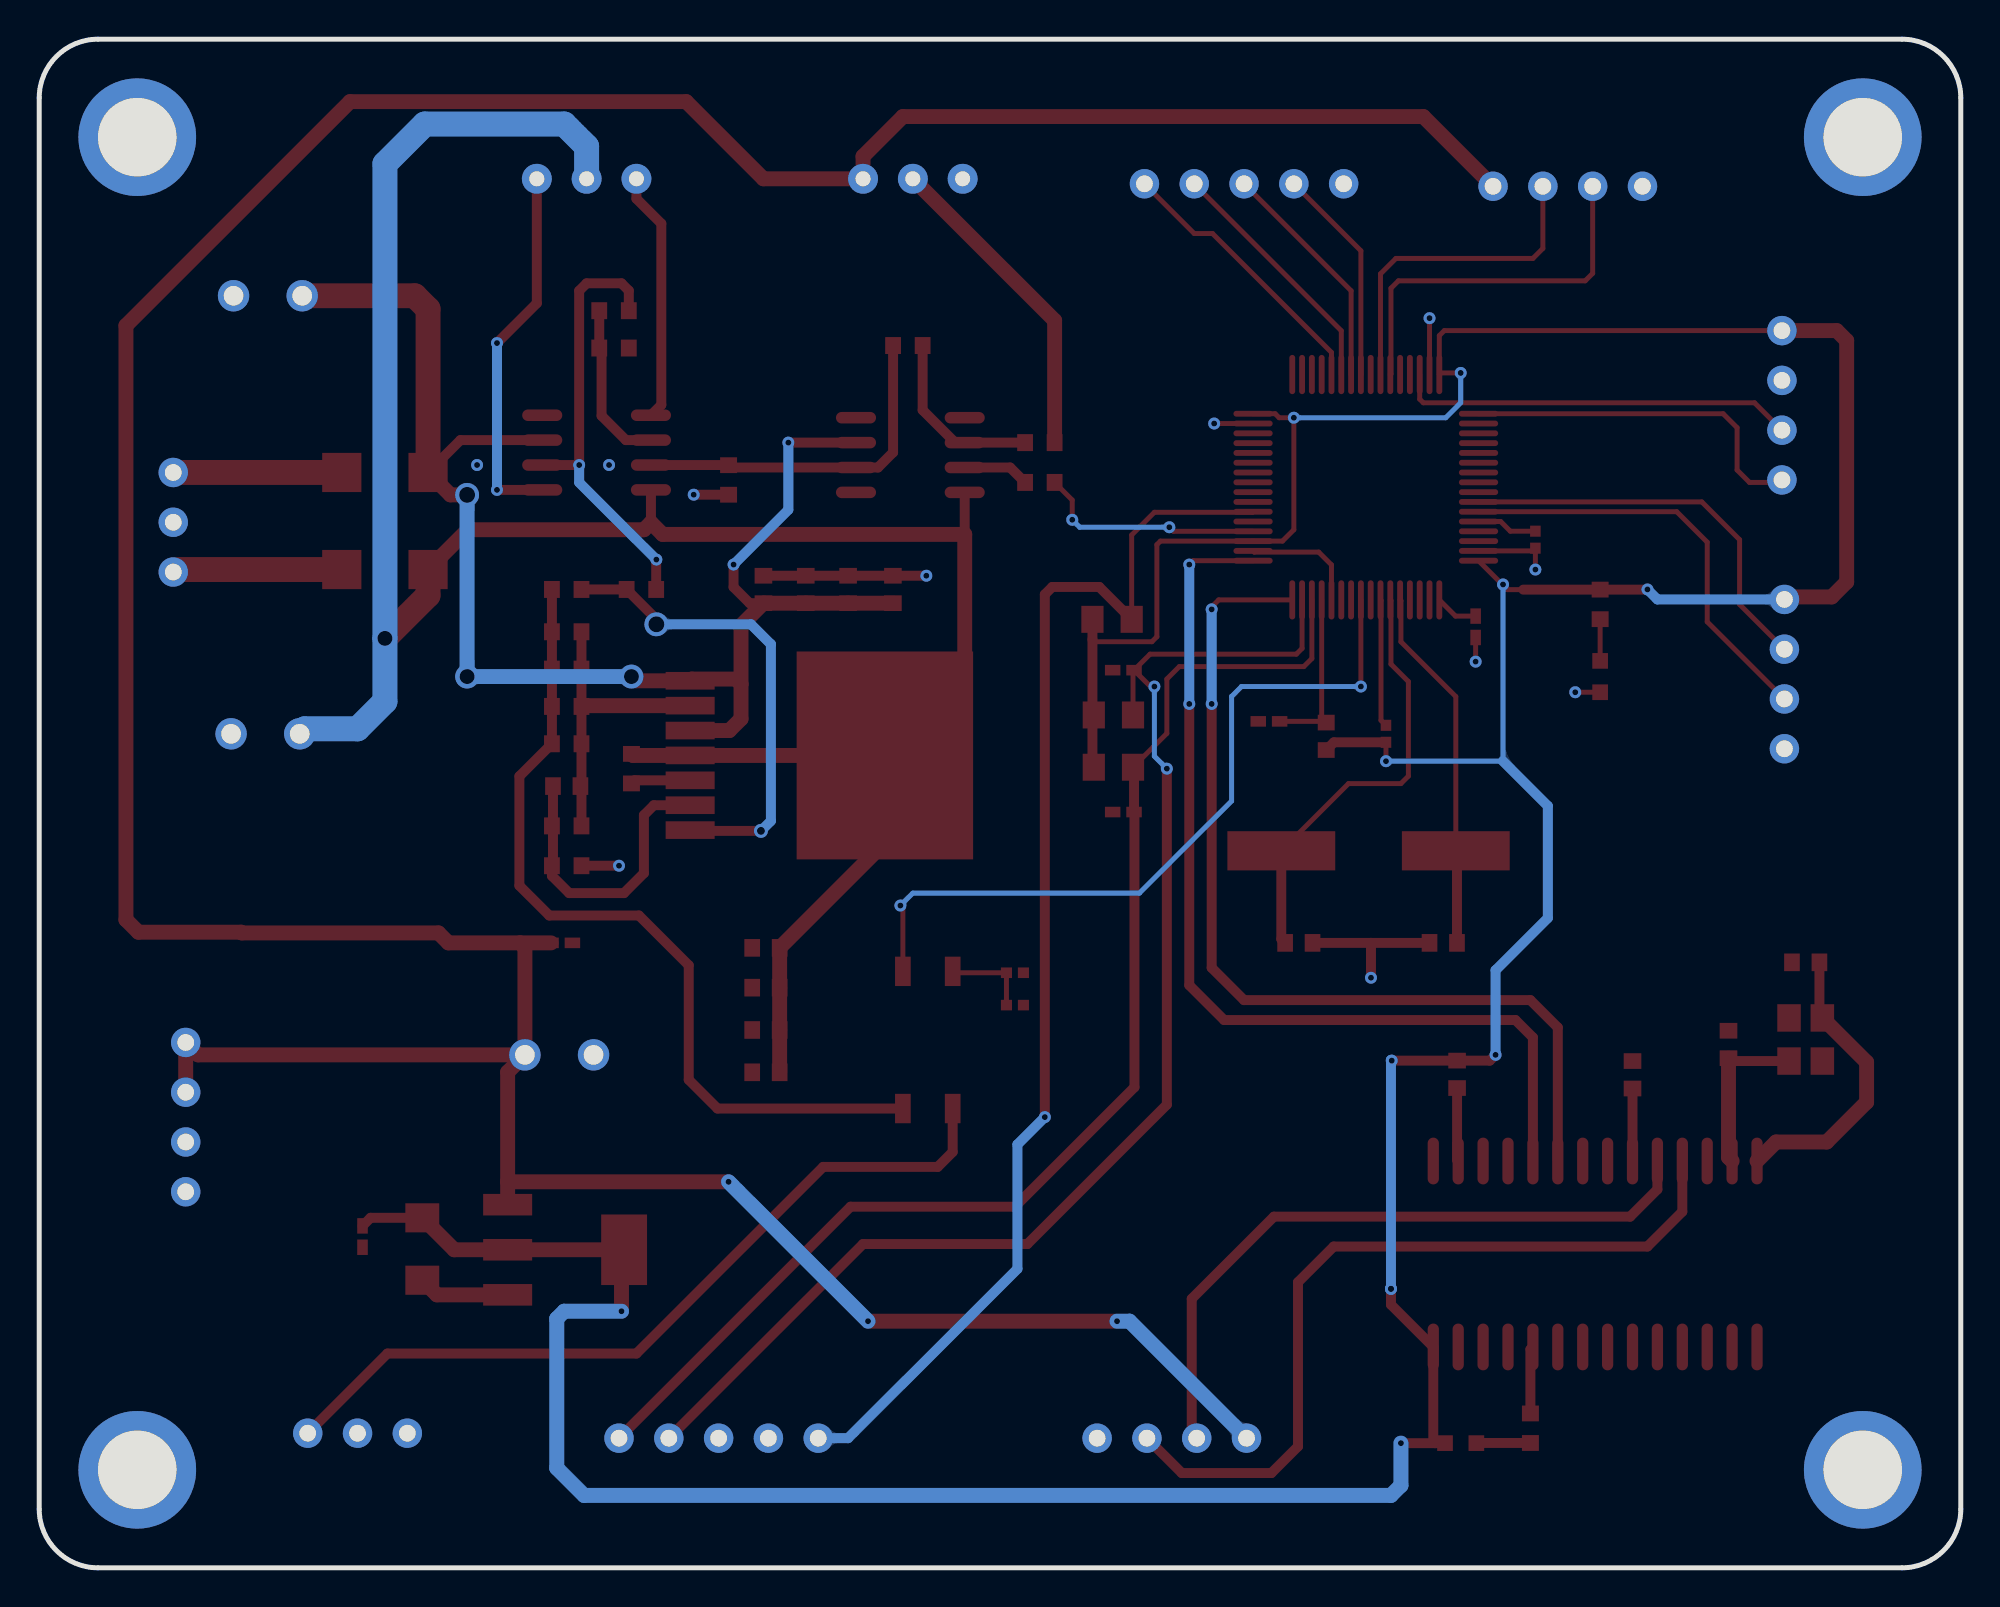
[diagram p4: board, bottom side, seen from below]

Outline 98 x 78 mm; copper layers: Top Layer, Bottom Layer. Coordinates in mm from the lower left corner of the outline.
Outline path: 0,75 0,3 arc(0.88,0.88) 3,0 95,0 arc(97.12,0.88) 98,3 98,75 arc(97.12,77.12) 95,78 3,78 arc(0.88,77.12) 0,75
Stack: Top Layer 0.035mm / Dielectric1 1.51mm FR4 er 4.5 / Bottom Layer 0.035mm

## Design rules (mm)
template: 自定义配置
spacing copperThickness1oz (default): track to track 0.102, other pairs 0.152 to 0.3
spacing copperThickness2oz: track to track 0.203, other pairs 0.152 to 0.3
track width copperThickness1oz (default): min 0.127, default 0.254, max 2.54
track width copperThickness2oz: min 0.203, default 0.254, max 2.54
differential pair differentialPair (default): width min 0.127, default 0.254, max 2.54; gap min 0.152, default 0.152
via viaSize (default): diameter min 0.5, default 0.61, max 10; hole min 0.3, default 0.305, max 6.3

## Placement (name value [footprint] x y rotation side)
C1  100nF  [C0402]  24.74 48.02 270 top
C2  100nF  [C0402]  35.28 43.19 0 top
C3  100nF  [C0402]  42.71 38.56 180 top
C4  100nF  [C0402]  42.71 45.8 180 top
C5  100nF  [C0402]  71.35 31.89 0 top
C6  470uF  [cap-th_bd8.0-p3.50-d0.6-fd_1]  71.48 26.17 180 top
C7  100nF  [C0402]  81.51 16.9 90 top
C8  100uF  [C1206]  78.46 16.27 90 top
C9  20pF  [C0603]  26.39 31.89 180 top
C10  20pF  [C0603]  33.76 31.89 0 top
C15  100nF  [C0603]  60.94 29.6 180 top
C16  10uF  [C0603]  60.94 25.28 180 top
C17  100nF  [C0603]  60.94 27.44 180 top
C18  10uF  [C0603]  60.94 31.63 180 top
C19  470uF  [cap-th_bd8.0-p3.50-d0.6-fd_1]  86.47 42.56 180 top
C20  100nF  [C0603]  54.46 49.92 90 top
C21  10uF  [C0603]  56.75 49.92 90 top
C22  100nF  [C0603]  58.91 49.92 90 top
C23  10uF  [C0603]  61.06 49.92 90 top
C24  470uF  [cap-th_bd8.0-p3.50-d0.6-fd_1]  86.34 64.91 0 top
C25  5pF  [C0603]  71.1 39.89 180 top
C27  10nF  [C0603]  16.74 25.16 270 top
C28  22pF  [C0603]  11.85 26.7 270 top
C29  22pF  [C0603]  7.91 30.89 180 top
D1  SS34  [SMA_L4.3-W2.6-LS5.2-RD]  80.37 55.89 0 top
D2  SS34  [SMA_L4.3-W2.6-LS5.2-RD]  80.37 50.94 180 top
J1  -  [CH2.54-3插座]  91.16 53.35 270 top
J2  -  [CH2.54-4插座]  20.04 70.5 0 top
J3  -  [CH2.54-4插座]  9 45.6 90 top
J5  -  [CH2.54-3插座]  81.77 6.87 180 top
J6  -  [CH2.54-4插座]  9.12 59.32 90 top
J8  -  [CH2.54-4插座]  40.24 6.62 180 top
J9  -  [CH2.54-4插座]  90.53 23 270 top
L1  CBG160808U000T  [L0603]  32.36 42.43 90 top
LED1  KT-0603R  [LED0603-RD]  18.39 45.48 90 top
LED2  KT-0603R  [LED0603-RD]  25.5 6.36 0 top
NOREF  -  [Pad_e108]  93 73 0 top
NOREF#2  -  [Pad_e107]  5 73 0 top
NOREF#3  -  [Pad_e110]  93 5 0 top
NOREF#4  -  [Pad_e109]  5 5 0 top
R1  10kΩ  [R0402]  21.69 52.46 270 top
R3  10kΩ  [R0805]  43.22 43.52 0 top
R4  10kΩ  [R0805]  43.22 40.85 0 top
R5  10kΩ  [R0805]  43.28 48.4 0 top
R6  4.7kΩ  [R0603]  18.39 49.16 90 top
R7  1kΩ  [R0603]  53.7 62.37 0 top
R8  1kΩ  [R0603]  46.97 57.42 0 top
R9  1kΩ  [R0603]  46.97 55.38 0 top
R10  NC  [R0603]  68.69 62.24 0 top
R11  1kΩ  [R0603]  68.69 64.15 180 top
R12  100kΩ  [R0603]  71.1 49.92 0 top
R13  24Ω  [R0603]  71.1 47.76 0 top
R14  12kΩ  [R0603]  67.8 40.78 90 top
R15  100kΩ  [R0603]  67.29 49.92 0 top
R16  24Ω  [R0603]  71.1 45.86 0 top
R17  3.6MΩ  [R0603]  62.84 55.51 90 top
R18  24Ω  [R0603]  71.1 43.95 0 top
R19  1KΩ  [RES-ADJ-TH_3296W]  70.08 70.88 270 top
R20  24Ω  [R0603]  71.1 42.05 0 top
R21  100kΩ  [R0603]  71.1 35.83 0 top
R22  100kΩ  [R0603]  71.1 37.86 180 top
R23  10kΩ  [R0402]  29.31 42.56 90 top
R24  1kΩ  [R0402]  48.24 30.36 0 top
R25  1kΩ  [R0402]  48.24 28.71 0 top
R26  1kΩ  [R0603]  21.95 7.12 270 top
U1  STM32F103RCT6  [LQFP-64_L10.0-W10.0-P0.50-LS12.0-BL]  30.34 55.14 0 top
U2  -  [CH2.54-5插座]  63.35 6.62 180 top
U3  AMS1117-3.3  [SOT-223-3_L6.5-W3.4-P2.30-LS7.0-BR]  71.14 16.23 0 top
U4  -  [CH2.54-5插座]  36.55 70.62 0 top
U6  OP07CDR  [SOIC-8_L4.9-W3.9-P1.27-LS6.0-BL]  53.57 56.78 270 top
U7  OPA445AU/2K5  [SOIC-8_L4.9-W3.9-P1.27-LS6.0-BL]  69.57 56.91 270 top
U8  OPA547FKTWT  [DDPAK-7_L10.2-W8.9-P1.27-LS14.0-BR]  59.84 41.45 0 top
U9  TLP172AM(TPL,E(O  [SMD-4_L4.6-W3.7-P2.54-LS7.0-BR]  52.68 26.94 90 top
U10  CH376S  [SOIC-28_L17.9-W7.5-P1.27-LS10.3-BL]  18.65 16.01 180 top
U11  0.47UF  [C0603]  25.69 25.18 270 top
W1  1kΩ  [RES-ADJ-TH_3296W]  53.44 70.88 90 top
X1  8MHz  [CRYSTAL-SMD_L11.5-W4.8-LS12.7]  30.2 36.59 180 top
X2  12MHz  [CRYSTAL-SMD_4P-L3.2-W2.5-BL]  7.91 26.96 90 top

## Footprints (pads in the part's own frame, mm; a bottom-side part is the same pattern mirrored in y, then rotated)
C0402
  rect 0.79x0.54 smd: 1(-0.545,0) 2(0.545,0)
C0603
  rect 0.8x0.9 smd: 1(-0.7,0) 2(0.7,0)
C1206
  rect 1.485x1.728 smd: 1(-1.593,0) 2(1.593,0)
cap-th_bd8.0-p3.50-d0.6-fd_1
  round 1.6 hole 1: 1(-1.75,0) 2(1.75,0)
CH2.54-3插座
  round 1.5 hole 0.85: 1(-2.54,0) 2(0,0) 3(2.54,0)
CH2.54-4插座
  round 1.5 hole 0.85: 1(-3.81,0) 2(-1.27,0) 3(1.27,0) 4(3.81,0)
CH2.54-5插座
  round 1.5 hole 0.85: 1(-5.08,0) 2(-2.54,0) 3(0,0) 4(2.54,0) 5(5.08,0)
CRYSTAL-SMD_4P-L3.2-W2.5-BL
  rect 1.4x1.2 smd: 1(-1.1,-0.85) 2(1.1,-0.85) 3(1.1,0.85) 4(-1.1,0.85)
CRYSTAL-SMD_L11.5-W4.8-LS12.7
  rect 5.5x2 smd: 1(-4.45,0) 2(4.45,0)
DDPAK-7_L10.2-W8.9-P1.27-LS14.0-BR
  rect 2.5x0.9 smd: 1(4.966,-3.81) 2(4.966,-2.54) 3(4.966,-1.27) 4(4.966,0) 5(4.966,1.27) 6(4.966,2.54) 7(4.966,3.81)
  rect 9x10.608 smd: 8(-4.966,0)
L0603
  rect 0.8x0.864 smd: 1(-0.7,0) 2(0.7,0)
LED0603-RD
  rect 0.8x0.8 smd: 1(-0.799,0) 2(0.799,0)
LQFP-64_L10.0-W10.0-P0.50-LS12.0-BL
  oval 0.3x2 smd: 1(-3.75,-5.75) 2(-3.25,-5.75) 3(-2.75,-5.75) 4(-2.25,-5.75) 5(-1.75,-5.75) 6(-1.25,-5.75) 7(-0.75,-5.75) 8(-0.25,-5.75) 9(0.25,-5.75) 10(0.75,-5.75) 11(1.25,-5.75) 12(1.75,-5.75) 13(2.25,-5.75) 14(2.75,-5.75) 15(3.25,-5.75) 16(3.75,-5.75) 33(3.75,5.75) 34(3.25,5.75) 35(2.75,5.75) 36(2.25,5.75) 37(1.75,5.75) 38(1.25,5.75) 39(0.75,5.75) 40(0.25,5.75) 41(-0.25,5.75) 42(-0.75,5.75) 43(-1.25,5.75) 44(-1.75,5.75) 45(-2.25,5.75) 46(-2.75,5.75) 47(-3.25,5.75) 48(-3.75,5.75)
  oval 2x0.3 smd: 17(5.75,-3.75) 18(5.75,-3.25) 19(5.75,-2.75) 20(5.75,-2.25) 21(5.75,-1.75) 22(5.75,-1.25) 23(5.75,-0.75) 24(5.75,-0.25) 25(5.75,0.25) 26(5.75,0.75) 27(5.75,1.25) 28(5.75,1.75) 29(5.75,2.25) 30(5.75,2.75) 31(5.75,3.25) 32(5.75,3.75) 49(-5.75,3.75) 50(-5.75,3.25) 51(-5.75,2.75) 52(-5.75,2.25) 53(-5.75,1.75) 54(-5.75,1.25) 55(-5.75,0.75) 56(-5.75,0.25) 57(-5.75,-0.25) 58(-5.75,-0.75) 59(-5.75,-1.25) 60(-5.75,-1.75) 61(-5.75,-2.25) 62(-5.75,-2.75) 63(-5.75,-3.25) 64(-5.75,-3.75)
Pad_e107
  round 6 hole 4: 1(0,0)
Pad_e108
  round 6 hole 4: 1(0,0)
Pad_e109
  round 6 hole 4: 1(0,0)
Pad_e110
  round 6 hole 4: 1(0,0)
R0402
  rect 0.566x0.54 smd: 1(-0.433,0) 2(0.433,0)
R0603
  rect 0.806x0.864 smd: 1(-0.753,0) 2(0.753,0)
R0805
  rect 1.133x1.377 smd: 1(-1,0) 2(1,0)
RES-ADJ-TH_3296W
  round 1.524 hole 0.762: 1(0,2.54) 2(0,0) 3(0,-2.54)
SMA_L4.3-W2.6-LS5.2-RD
  rect 2x2 smd: 1(-2.2,0) 2(2.2,0)
SMD-4_L4.6-W3.7-P2.54-LS7.0-BR
  rect 1.5x0.8 smd: 1(3.5,-1.27) 2(3.5,1.27) 3(-3.5,1.27) 4(-3.5,-1.27)
SOIC-8_L4.9-W3.9-P1.27-LS6.0-BL
  oval 0.588x2.045 smd: 1(-1.905,-2.772) 2(-0.635,-2.772) 3(0.635,-2.772) 4(1.905,-2.772) 5(1.905,2.772) 6(0.635,2.772) 7(-0.635,2.772) 8(-1.905,2.772)
SOIC-28_L17.9-W7.5-P1.27-LS10.3-BL
  oval 0.574x2.388 smd: 1(-8.255,-4.744) 2(-6.985,-4.744) 3(-5.715,-4.744) 4(-4.445,-4.744) 5(-3.175,-4.744) 6(-1.905,-4.744) 7(-0.635,-4.744) 8(0.635,-4.744) 9(1.905,-4.744) 10(3.175,-4.744) 11(4.445,-4.744) 12(5.715,-4.744) 13(6.985,-4.744) 14(8.255,-4.744) 15(8.255,4.744) 16(6.985,4.744) 17(5.715,4.744) 18(4.445,4.744) 19(3.175,4.744) 20(1.905,4.744) 21(0.635,4.744) 22(-0.635,4.744) 23(-1.905,4.744) 24(-3.175,4.744) 25(-4.445,4.744) 26(-5.715,4.744) 27(-6.985,4.744) 28(-8.255,4.744)
SOT-223-3_L6.5-W3.4-P2.30-LS7.0-BR
  rect 2.5x1.1 smd: 1(2.97,-2.3) 2(2.97,0) 3(2.97,2.3)
  rect 2.34x3.6 smd: 4(-2.97,0)

## Nets
As in the schematic, except:
GND: C1.2 C2.2 C3.1 C4.1 C5.1 C6.2 C7.1 C8.1 C9.1 C10.1 C15.1 C16.1 C17.1 C18.1 C19.1 C20.2 C21.2 C22.2 C23.2 C24.2 C27.1 C28.1 C29.1 J1.2 J2.1 J3.1 J5.2 J5.3 J6.3 J8.1 J9.3 J9.4 LED1.1 NOREF.1 NOREF#2.1 NOREF#3.1 NOREF#4.1 R1.2 R10.1 R17.1 R21.1 R24.1 R25.1 U1.12 U1.18 U1.31 U1.47 U1.63 U2.3 U2.4 U3.1 U4.1 U10.12 U10.23 W1.1 X2.2 X2.4

Pads without a net: U1 2 3 4 8 10 11 21 23 24 25 26 27 28 29 30 33 34 35 36 41 44 45 50 51 52 53 54 55 56 57 61 62; U6 1 5 8; U7 8; U10 1 3 4 7 8 15 16 17 18 19 20 21 22 25 26 27

## Via types
v1: diameter 0.61, hole 0.305, Top Layer to Bottom Layer, 42 vias
v2: diameter 1.219, hole 0.762, Top Layer to Bottom Layer, 3 vias
v3: diameter 1.219, hole 0.813, Top Layer to Bottom Layer, 2 vias
v4: diameter 0.711, hole 0.406, Top Layer to Bottom Layer, 1 via

## Routing (per net, layer and track width the routed paths; a pad name or vN(x,y) marks a point on that pad's centre or on a via; arc(x,y) is an arc through that point)
+3V: length 16.5
  Top Layer w0.762: W1.2 46.21,63.65 R8.1
+3V3: length 236.5
  Top Layer w0.254: 29.31,42.12 v1(29.31,41.16) ; U1.64 23.12,49.91 22.31,49.91 ; U1.32 34.97,58.89 34.76,58.69 v1(34.01,58.69) 34.01,52.97 34.59,52.39 U1.19 40.82,52.39 41,52.21 41,47.51 41.25,47.25 44.17,47.25 44.28,47.37 ; v1(25.5,60.97) 26.51,60.97 U1.48 26.59,62.88 26.34,63.13 J6.4
  Top Layer w0.508: 26.81,6.36 26.9,6.45 U10.28 29.06,13.43 v1(29.06,14.24) ; 26.81,6.36 LED2.2 ; 26.81,6.36 v1(28.55,6.36) ; 29.31,42.12 31.97,42.12 L1.1 ; R4.2 44.28,40.92 R5.2 ; v1(15.98,49.92) 15.99,49.91 R6.2 22.31,49.91 ; 81.51,17.45 81.1,17.86 C8.2 ; v1(23.73,26.17) 24.02,25.88 U11.1 v1(29.02,25.88)
  Top Layer w0.762: C8.2 76.83,16.23 U3.2 U3.4 68.3,16.09 v1(68.3,13.09) ; J3.4 8.87,49.54 6.58,49.54 5.82,50.3 5.82,62.62 6.33,63.13 J6.4
  Bottom Layer w0.254: v1(25.5,60.97) 25.5,59.45 26.27,58.69 v1(34.01,58.69) ; v1(23.35,50.18) 23.35,41.16 v1(29.31,41.16)
  Bottom Layer w0.508: 23.35,41.16 21.06,38.87 21.06,33.16 23.73,30.49 v1(23.73,26.17) ; J3.4 15.47,49.41 v1(15.98,49.92) ; v1(29.06,14.24) 29.06,25.92
  Bottom Layer w0.762: v1(68.3,13.09) 71.22,13.09 71.61,12.71 71.61,5.09 70.21,3.69 29.06,3.69 28.55,4.2 v1(28.55,6.36)
+5V: length 209.1
  Top Layer w0.762: 74.11,19.71 74.1,19.7 v1(62.84,19.7) ; 74.11,19.71 U3.3 ; 74.11,19.71 74.11,25.29 C6.1 ; C5.2 73.47,31.89 ; 73.47,31.89 77.13,31.89 77.64,32.4 87.67,32.4 87.7,32.43 92.94,32.43 93.58,33.07 93.58,63.38 82.15,74.81 65,74.81 61.06,70.88 W1.3 55.99,72.02 53.95,74.05 27.41,74.05 J2.4 ; 73.47,31.89 73.23,31.64 C6.1 ; C6.1 89.89,26.17 J9.1 J9.2 ; v1(43.03,12.58) v1(55.73,12.58)
  Bottom Layer w0.762: v1(55.73,12.58) v1(62.84,19.7) ; v1(43.03,12.58) 42.4,12.58 J8.4
+12V: length 77.3
  Top Layer w0.508: v1(59.79,57.42) U6.7 ; v1(62.59,51.19) 62.59,50.04 61.77,49.22 C23.1 ; U7.7 76.52,57.54 D1.1
  Top Layer w0.762: D1.1 77.03,54.75 v3(76.18,54.75) ; U8.5 62.8,42.72 62.21,43.32 62.21,45.1 ; 62.21,45.1 62.46,45.35 64.72,45.35 U8.7 67.58,45.26 v2(67.8,45.48) ; 62.21,45.1 62.21,48.08 C23.1 C22.1 C21.1 C20.1
  Top Layer w1.27: C24.1 78.84,64.91 78.17,64.23 D1.1
  Bottom Layer w0.508: v1(59.79,57.42) 59.79,53.99 v1(62.59,51.19)
  Bottom Layer w0.762: v3(76.18,54.75) v2(76.18,45.48) 67.67,45.48
-12V: length 126.7
  Top Layer w0.508: 66.8,53.33 U7.4 ; U6.4 50.8,52.73
  Top Layer w0.762: 55.2,41.45 55.2,36.68 C18.2 C15.2 C17.2 C16.2 ; 55.2,41.45 U8.4 67.72,41.45 R14.2 ; 55.2,41.45 54.87,41.45 50.8,45.52 50.8,52.73 66.2,52.73 66.8,53.33 67.16,52.97 76.14,52.97 D2.2
  Top Layer w1.27: v2(80.37,47.43) 78.17,49.62 D2.2
  Bottom Layer w1.27: R19.2 70.08,72.53 71.22,73.67 78.34,73.67 80.37,71.64 v2(80.37,47.43) 80.37,44.21 81.77,42.81 84.46,42.81 C19.2
GND: length 41.9
  Top Layer w0.254: v1(21.69,50.94) R1.2 21.83,51.89 U1.63 ; U1.18 36.03,51.83 32.74,51.83 32.09,51.18 U1.12 ; U1.31 v1(38.08,58.39) ; LED1.1 v1(19.66,44.68) ; U1.47 v1(27.09,63.77) ; C1.2 v1(24.74,46.24)
  Top Layer w0.508: C9.1 30.08,31.89 ; 30.08,31.89 v1(30.08,30.11) ; 30.08,31.89 C10.1 ; R21.1 v1(68.43,35.83) ; v1(52.76,50.62) C20.2 C21.2 C22.2 C23.2 ; R17.1 v1(64.62,54.76)
  Top Layer w0.762: U3.1 77.72,13.93 C8.1
  vias: v1(68.94,56.27) v1(75.67,56.27)
VCC_IN: length 8.6
  Top Layer w1.27: D1.2 J1.1
VSS_IN: length 8.6
  Top Layer w1.27: D2.1 91.04,50.94 J1.3
A: length 66.1
  Top Layer w0.254: R4.1 40.49,42.58 40.49,45.35 39.86,45.98 33.51,45.98 33.09,46.4 U1.14
  Top Layer w0.508: R4.1 42.16,40.8 C3.2 42.14,38.54 42.14,24.52 48.24,18.43 56.62,18.43 U2.1
B: length 69.2
  Top Layer w0.254: C4.2 42.22,45.75 R3.1 ; C4.2 41.33,44.97 v1(41.13,44.97) ; C4.2 41.35,46.62 33.89,46.62 33.59,46.91 U1.15
  Top Layer w0.508: U2.2 55.99,16.52 47.6,16.52 40.49,23.63 v1(40.49,40.78)
  Bottom Layer w0.254: v1(41.13,44.97) 41.13,41.41 v1(40.49,40.78)
CANCEL: length 14.2
  Top Layer w0.254: U1.37 32.09,62.02 38.16,68.08 39.09,68.08 U4.5
CLK: length 18.2
  Top Layer w0.254: J6.1 9.25,55.38 10.77,55.38 11.41,56.02 11.41,58.18 12.12,58.89 U1.49
CONFIRM: length 12.8
  Top Layer w0.254: U1.38 31.59,63.12 U4.4
CTRL: length 18.2
  Top Layer w0.508: U7.3 62.85,56.27 R17.2 62.72,56.14 U6.6 55.22,56.14 54.45,56.92 R7.2
D+: length 34.7
  Top Layer w0.508: U10.10 15.47,19.31 16.86,17.92 35.03,17.92 39.22,13.73 39.22,6.87 38.97,6.62
D-: length 41.1
  Top Layer w0.508: J8.2 39.73,4.84 35.16,4.84 33.8,6.19 33.8,14.57 31.98,16.39 15.98,16.39 14.2,18.17 U10.11
DAC: length 11.7
  Top Layer w0.254: U1.20 40.16,52.89 v1(40.36,53.1) ; v1(45.32,53.48) 45.32,54.49 R9.1
  Bottom Layer w0.254: v1(40.36,53.1) 44.94,53.1 v1(45.32,53.48)
DIO: length 20.4
  Top Layer w0.254: J6.2 10.52,59.45 27.41,59.45 27.59,59.63 U1.46
DOWN: length 12
  Top Layer w0.254: 31.09,60.89 31.09,65.16 U4.3
KEY: length 65
  Top Layer w0.254: R5.1 42.28,52.7 41.13,53.86 36.12,53.86 U1.22
  Top Layer w0.508: v1(46.71,23) 46.71,49.67 46.33,50.05 43.94,50.05 R5.1
  Bottom Layer w0.508: v1(46.71,23) 48.11,21.6 48.11,15.25 56.75,6.62 U2.5
OSC_IN: length 18.7
  Top Layer w0.254: U1.5 28.55,49.35 28.55,47.25 25.75,44.46 X1.2
  Top Layer w0.508: C9.2 25.69,36.53 X1.2
OSC_OUT: length 22.2
  Top Layer w0.254: X1.1 31.22,40.02 28.55,40.02 28.17,40.4 28.17,45.22 29.06,46.11 29.06,49.36 U1.6
  Top Layer w0.508: C10.2 34.65,32.08 X1.1
RX1: length 19.5
  Top Layer w0.254: J2.2 18.77,66.05 19.16,65.67 28.68,65.67 29.06,65.29 29.06,60.92 U1.43
RX2: length 49.7
  Top Layer w0.254: U1.17 39.15,51.39 v1(39.35,51.19)
  Top Layer w0.508: U10.5 21.82,27.06 22.71,27.95 37.57,27.95 39.35,29.73 v1(39.35,44.08)
  Bottom Layer w0.508: v1(39.35,44.08) v1(39.35,51.19)
SCL1: length 20.6
  Top Layer w0.254: U1.58 13.21,54.39 11.28,52.46 11.28,49.16 J3.3
SDA1: length 21.9
  Top Layer w0.254: U1.59 14.49,53.89 12.93,52.33 12.93,48.27 J3.2
SW1: length 39.1
  Top Layer w0.254: U9.1 53.95,33.67 v1(54.08,33.79) ; U1.9 v1(30.59,44.97)
  Bottom Layer w0.254: v1(30.59,44.97) 36.68,44.97 37.19,44.46 37.19,39.13 41.89,34.43 53.44,34.43 v1(54.08,33.79)
TX1: length 17.1
  Top Layer w0.254: U1.42 29.59,66.03 28.81,66.81 21.82,66.81 21.31,67.32 J2.3
TX2: length 48.3
  Top Layer w0.254: U1.16 37.85,49.39 38.21,49.03
  Top Layer w0.508: U10.6 20.55,27.57 21.95,28.97 36.55,28.97 38.21,30.62 v1(38.21,44.08)
  Bottom Layer w0.508: v1(38.21,44.08) v1(38.21,48.91)
UP: length 11.2
  Top Layer w0.254: U4.2 30.59,67.2 U1.40
$1N5288: length 2.2
  Top Layer w0.254: U1.1 25.77,48.56 C1.1
$1N5549: length 6.5
  Top Layer w0.254: R23.2 29.57,43.24 29.57,49.36 U1.7
$1N5845: length 3.1
  Top Layer w0.254: U1.60 23.47,53.39 22.97,52.89 R1.1
$1N6099: length 8.7
  Top Layer w0.254: 32.43,43.19 32.59,43.36 U1.13 ; 32.43,43.19 C2.1 ; 32.43,43.19 L1.2
$1N6322: length 2.1
  Top Layer w0.254: LED1.2 R6.1
$2N1370: length 8.4
  Top Layer w0.508: U7.2 68.08,57.54 69.32,58.78 69.32,62.12 R10.2 R11.1
$2N1409: length 12.8
  Top Layer w0.508: U7.1 66.27,59.34 66.27,68.59 67.54,69.86 R19.3
$2N1488: length 19
  Top Layer w0.508: R19.1 72.62,64.53 v1(74.65,62.5) ; v1(74.65,55) U7.5
  Bottom Layer w0.508: v1(74.65,62.5) v1(74.65,55)
$2N1705: length 22.6
  Top Layer w0.508: U7.6 v1(70.46,56.27) 70.46,65.16 70.08,65.54 68.3,65.54 67.93,65.17 R11.2 ; R15.1 66.53,51.44 v1(66.53,51.45)
  Bottom Layer w0.508: v1(66.53,51.45) 70.46,55.38 v1(70.46,56.27)
$2N1917: length 15.6
  Top Layer w0.508: U8.2 66.65,38.91 67.16,38.4 67.16,35.44 68.18,34.43 70.97,34.43 71.85,35.31 R21.2 71.8,35.88 C25.1
$2N2163: length 15.5
  Top Layer w0.508: R22.2 R20.1 R18.1 R16.1 R13.1
  Top Layer w0.762: R18.1 70.31,43.99 U8.6
$2N2269: length 24.3
  Top Layer w0.508: v3(66.53,48.14) 66.53,48.41 R15.2 R12.1 ; v4(61.19,37.6) 64.76,37.6 U8.1
  Bottom Layer w0.508: v3(66.53,48.14) 61.7,48.14 60.68,47.13 60.68,38.11 v4(61.19,37.6)
$2N2430: length 3.1
  Top Layer w0.508: U8.3 67.64,40.18 R14.1
$2N2682: length 3.4
  Top Layer w0.508: U6.3 48.48,56.14 R9.2
$2N2683: length 9.2
  Top Layer w0.508: R8.2 U6.2 51.29,57.42 52.95,59.07 R7.1
$2N3318: length 4.4
  Top Layer w0.254: R25.2 R24.2 51.34,30.36 U9.2
$2N3340: length 43.5
  Top Layer w0.508: R12.2 R13.2 R16.2 R18.2 R20.2 73.51,40.39 73.51,34.81 71.99,33.28 67.41,33.28 64.88,30.75 64.88,24.9 63.41,23.44 U9.4
$2N3364: length 41.1
  Top Layer w0.508: J5.1 80.24,10.93 67.54,10.93 58.02,20.46 52.18,20.46 51.41,21.22 U9.3
$3N166: length 3.4
  Top Layer w0.508: R26.1 21.95,11.14 U10.24
$3N256: length 2.7
  Top Layer w0.508: 24.62,6.45 24.53,6.37 R26.2
$3N657: length 3.7
  Top Layer w0.508: U11.2 25.69,20.81 U10.2
$3N957: length 3.7
  Top Layer w0.508: C27.2 U10.9
$3N1245: length 8.5
  Top Layer w0.508: C28.2 11.7,25.86 X2.1
  Top Layer w0.762: U10.13 11.85,20.94 C28.2
$3N1251: length 15
  Top Layer w0.508: X2.3 7.21,28.21 C29.2
  Top Layer w0.762: X2.3 4.8,25.8 4.8,23.76 6.84,21.73 9.42,21.73 U10.14

## Copper pours and planes (outline as drawn; the poured copper is in the pictures)
GND on Top Layer: -11.58,88.15 109.45,88.15 109.45,-14.34 -11.58,-14.34
GND on Bottom Layer: -9.93,92.97 110.21,92.97 110.21,-16.37 -9.93,-16.37

Small or netless copper shapes (teardrops, artwork), in the pictures only: 265 on Top Layer, 20 on Bottom Layer

## Text on the board
Top Silkscreen Layer: +3V3 | SCL | SDA | GND | CLK | DIO | RX | TX | +5V | UP | DOWN | CONF | CANC | K | B | A | OUT | +3V | VCC | VSS | D+ | D- | 偏移调节
